# EasyEDA Pro project LEGO_HUB_v2_2026-03-08.epro

# Schematic Schematic1_1

## Sheets
1 P1: Board Name: Main_Board; Create Date: 2026-01-28; Page Name: P1; Project Name: LEGO_HUB_v2; Schematic Name: Schematic1_1; Update Date: 2026-02-18; Company: EasyEDA.com; Page Size: A4; Version: V2.0
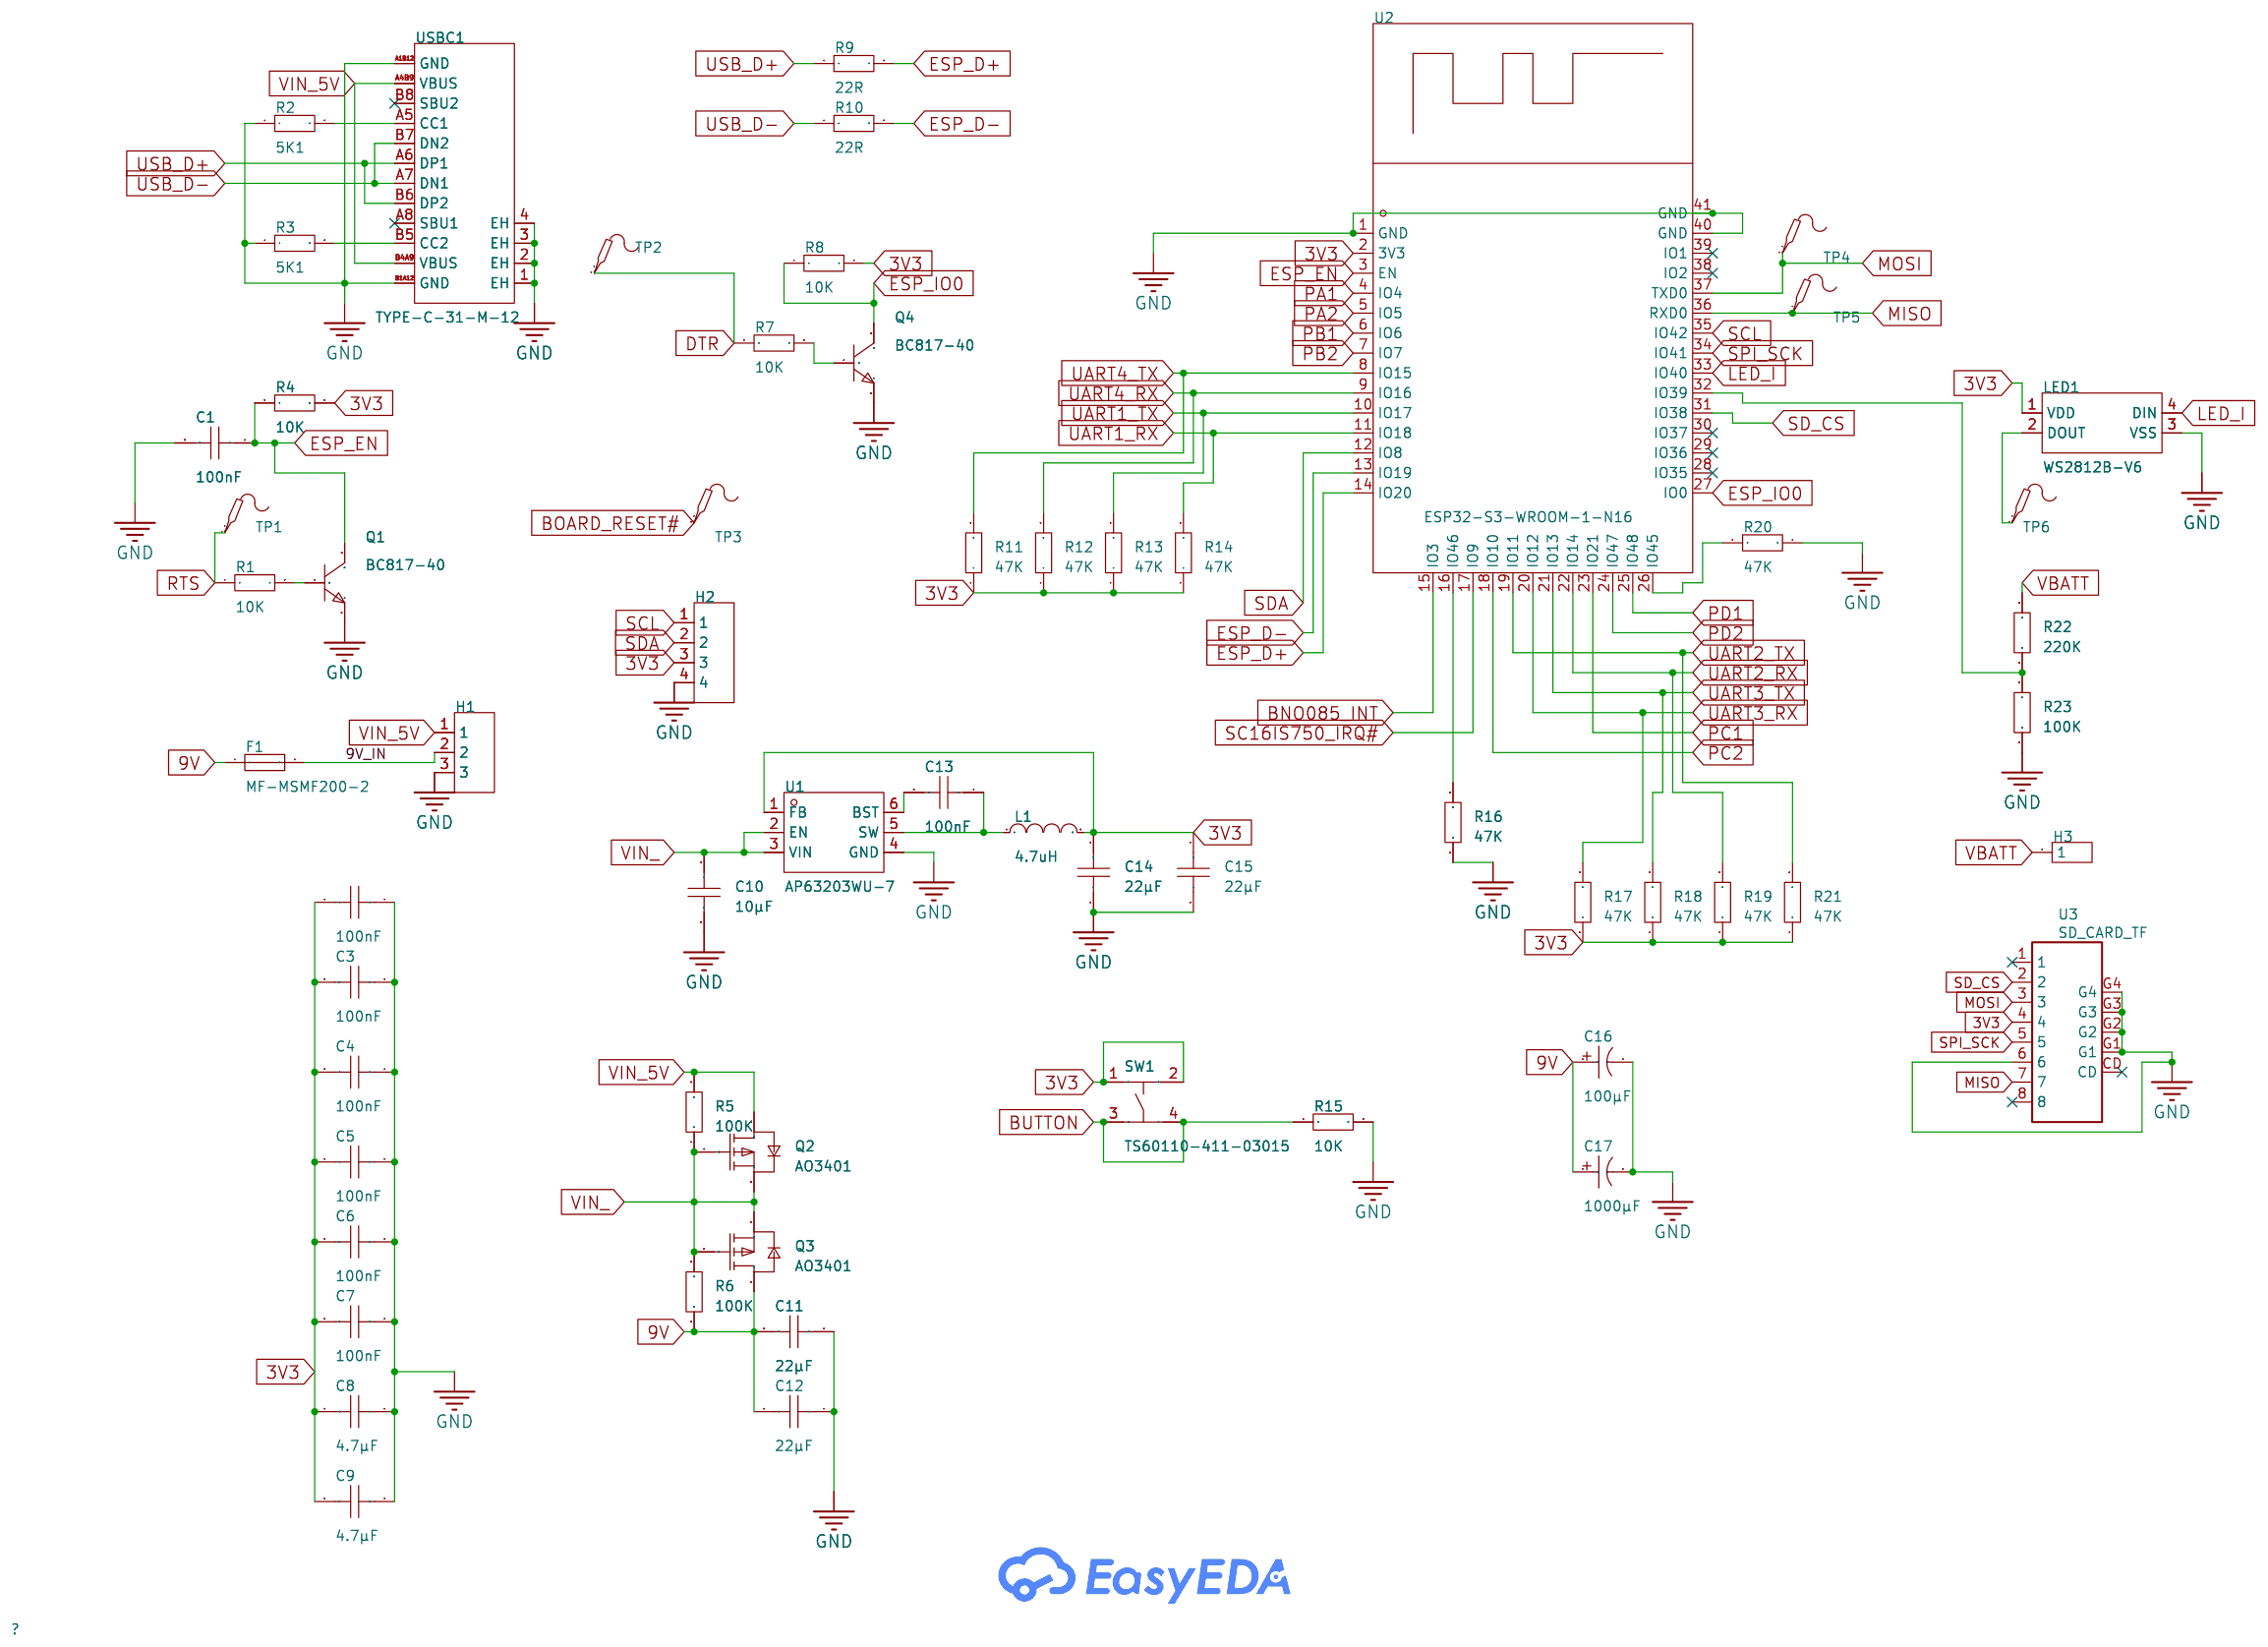
[diagram p0: P1]
2 P2: Page Name: P2; Update Date: 2026-01-28
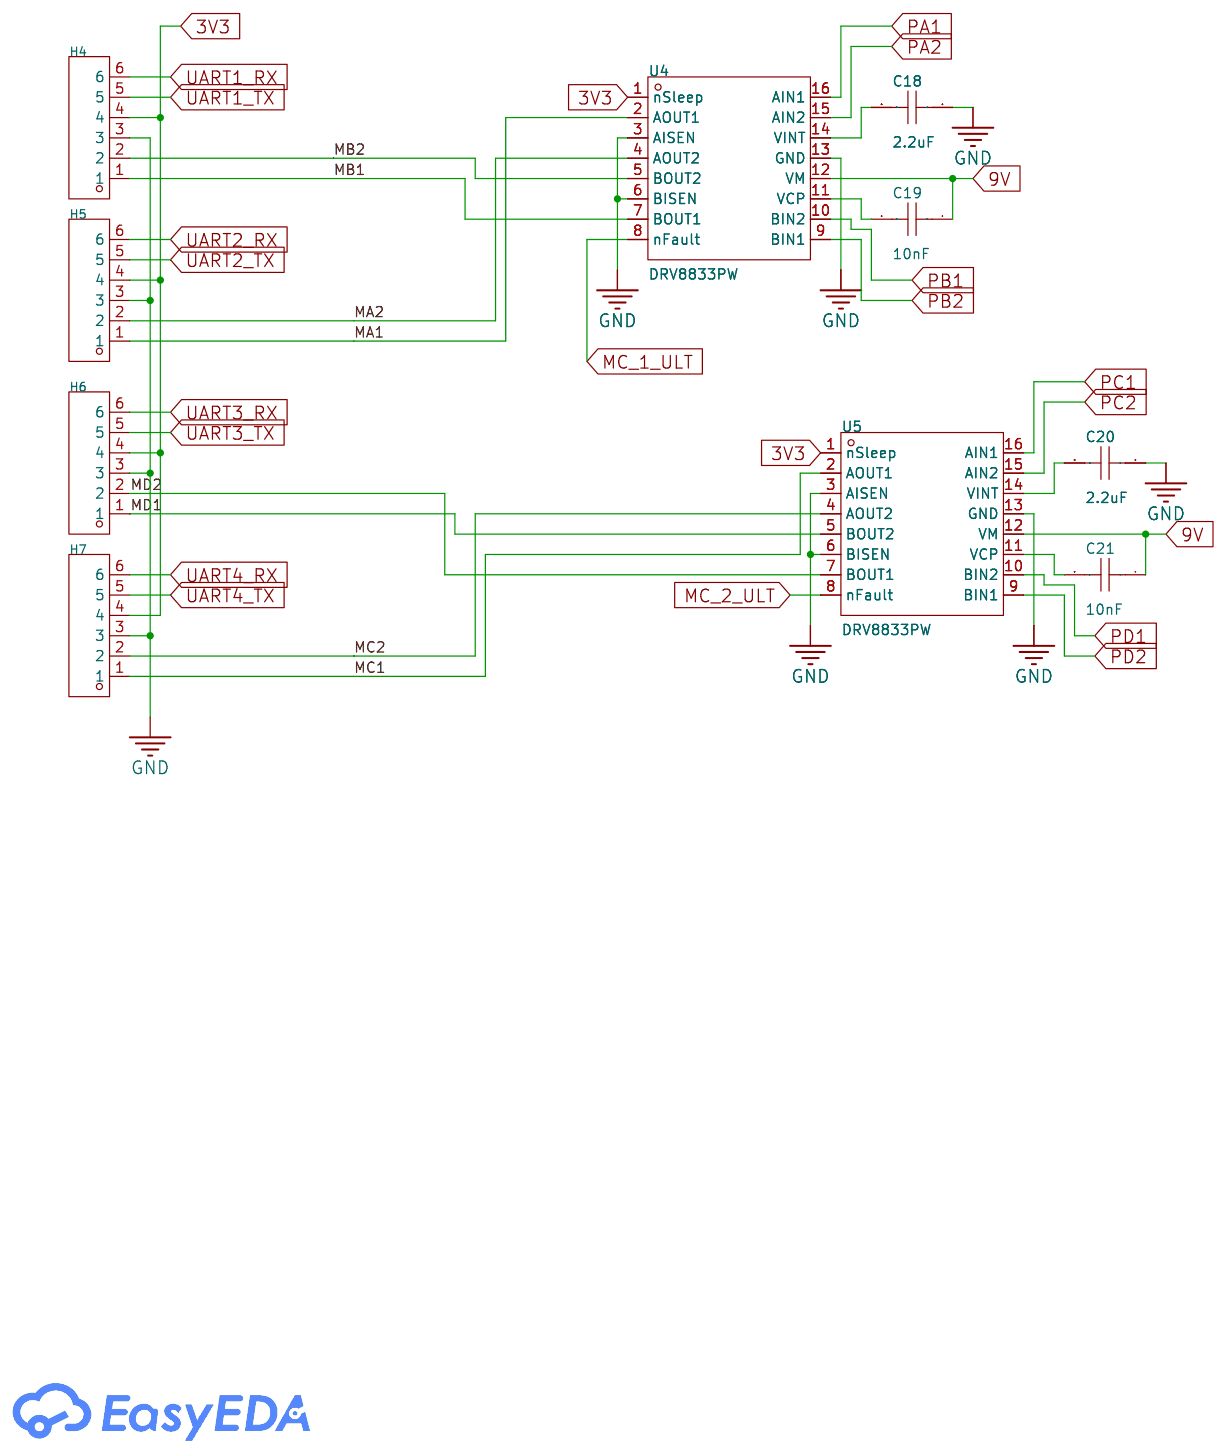
[diagram p1: P2]
3 P3: Page Name: P3; Update Date: 2026-01-28
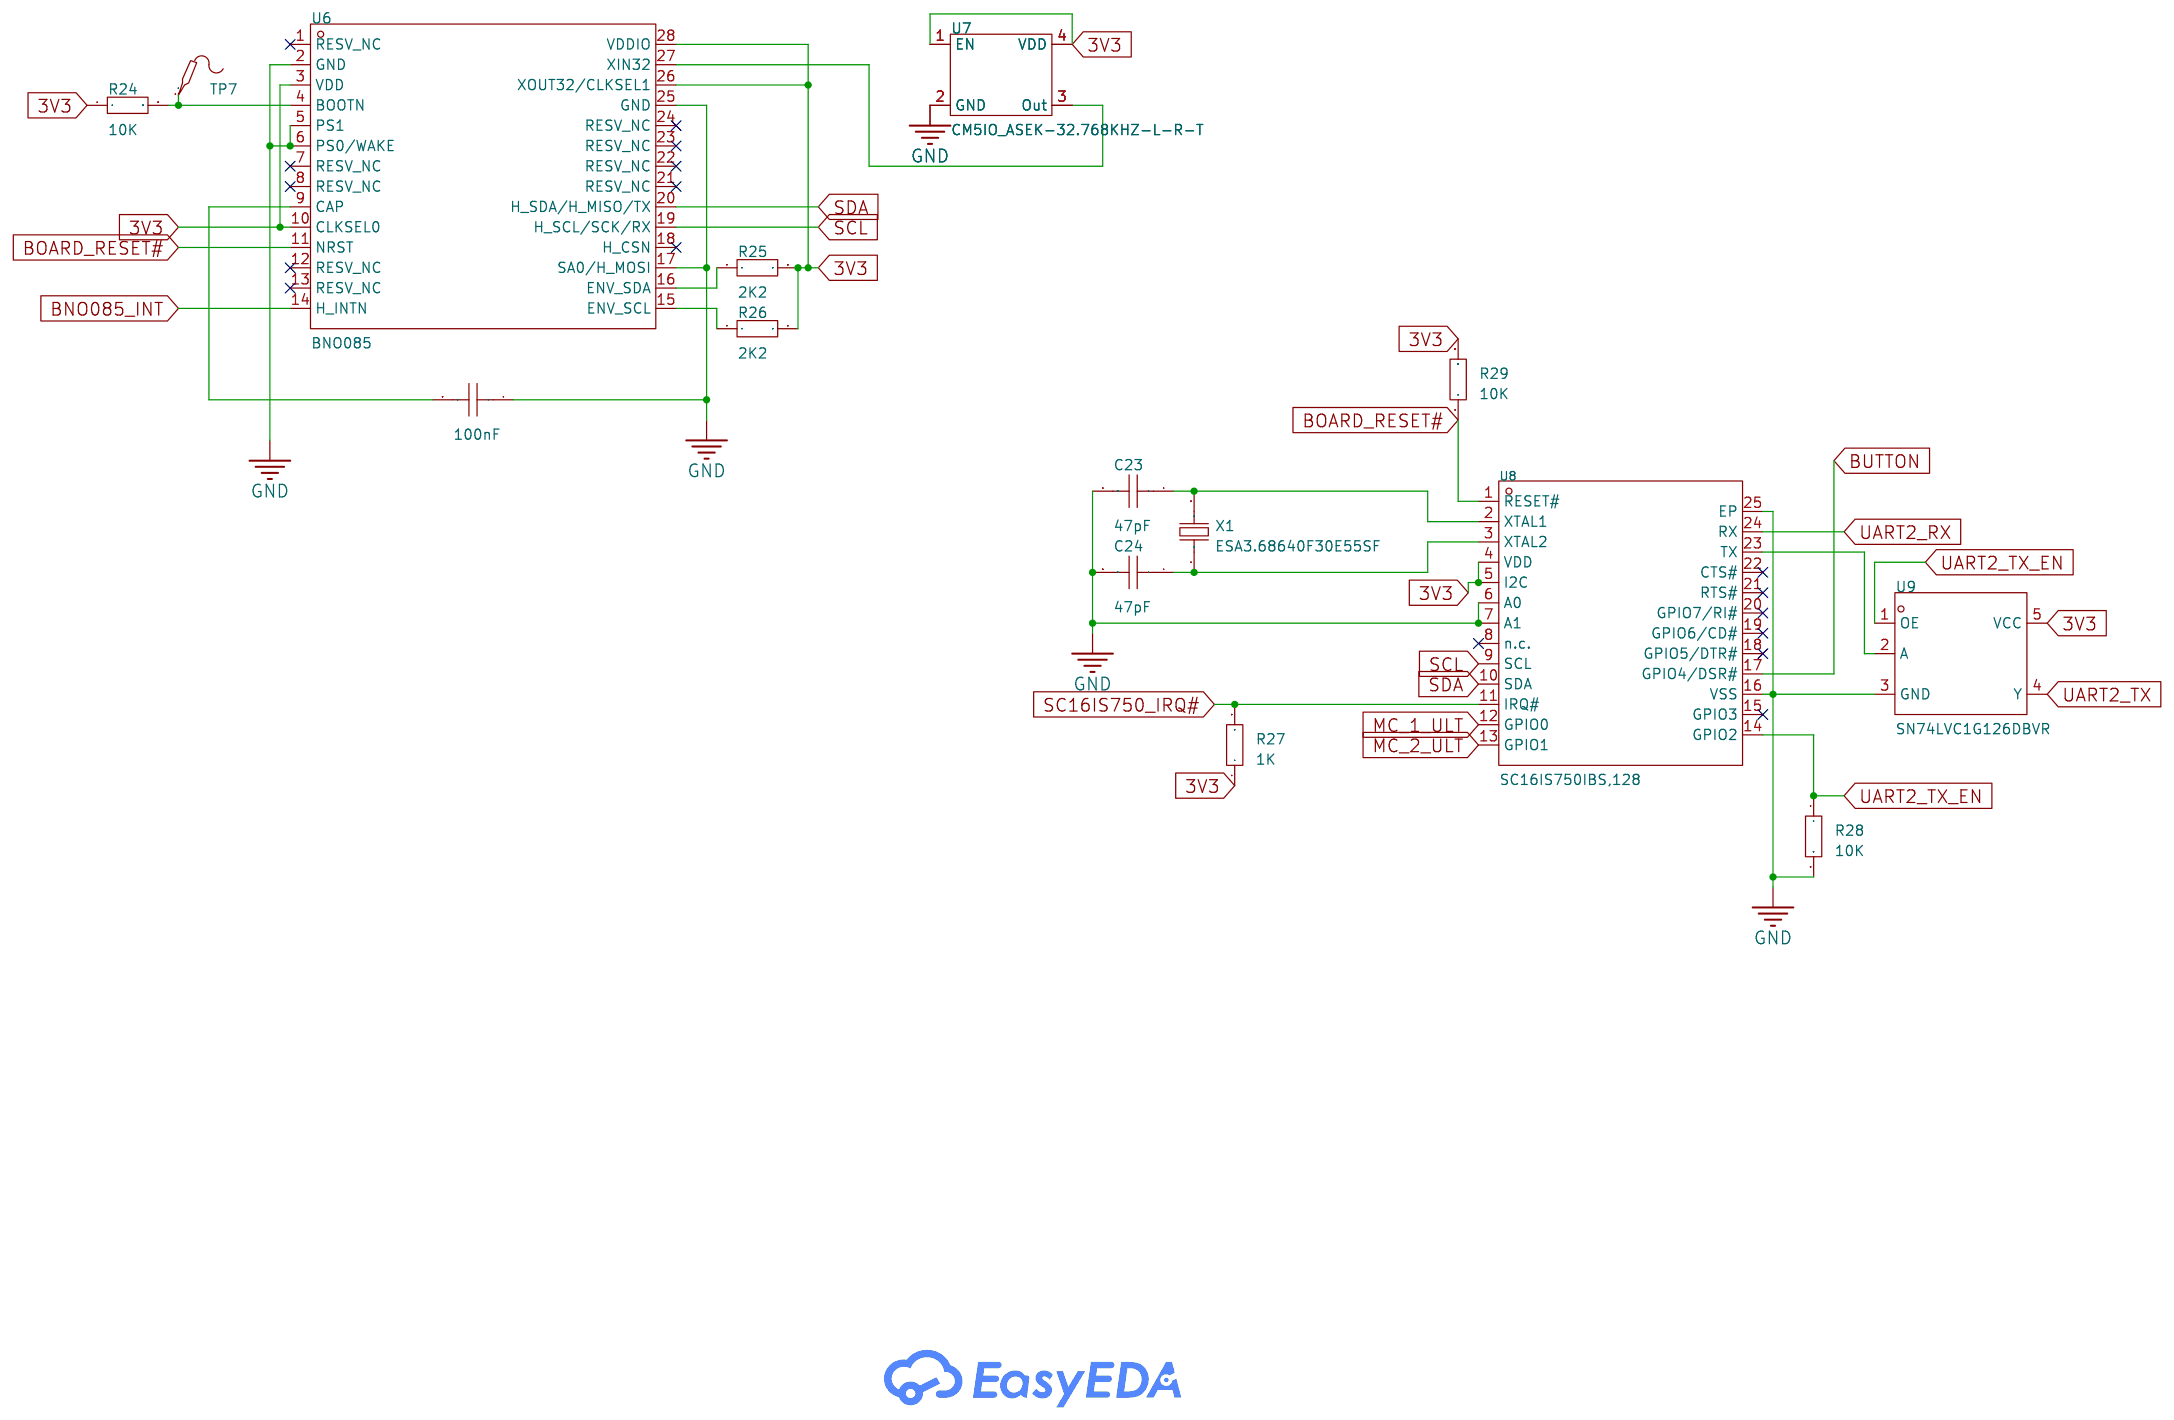
[diagram p2: P3]

## Parts
sheet P1
C1  100nF  [C0603]
C2  100nF  [C0603]
C3  100nF  [C0603]
C4  100nF  [C0603]
C5  100nF  [C0603]
C6  100nF  [C0603]
C7  100nF  [C0603]
C8  4.7μF  [C0805]
C9  4.7μF  [C0805]
C10  10μF  [C0603]
C11  22μF  [C0805]
C12  22μF  [C0805]
C13  100nF  [C0603]
C14  22μF  [C0603]
C15  22μF  [C0603]
C16  100μF  [CAP-TH_BD6.3-P2.50-D1.0-FD]
C17  1000μF  [CAP-TH_BD10.0-P5.00-D1.0-FD]
F1  MF-MSMF200-2  [F1812]
H1  -  [HDR-TH_3P-P2.54-V-F]
H2  -  [HDR-TH_4P-P2.54-V-M]
H3  -  [HDR-TH_1P-V-M_XKB_X4611WV-01I-C28D40]
L1  4.7uH  [IND-SMD_L5.8-W5.2]
LED1  WS2812B-V6  [LED-SMD_4P-L5.0-W5.0-TL-A]
Q1  BC817-40  [SOT-23-3_L2.9-W1.3-P1.90-LS2.4-BR]
Q2  AO3401  [SOT-23-3_L2.9-W1.3-P1.90-LS2.4-BR]
Q3  AO3401  [SOT-23-3_L2.9-W1.3-P1.90-LS2.4-BR]
Q4  BC817-40  [SOT-23-3_L2.9-W1.3-P1.90-LS2.4-BR]
R1  10K  [R0603]
R2  5K1  [R0603]
R3  5K1  [R0603]
R4  10K  [R0603]
R5  100K  [R0603]
R6  100K  [R0603]
R7  10K  [R0603]
R8  10K  [R0603]
R9  22R  [R0603]
R10  22R  [R0603]
R11  47K  [R0603]
R12  47K  [R0603]
R13  47K  [R0603]
R14  47K  [R0603]
R15  10K  [R0603]
R16  47K  [R0603]
R17  47K  [R0603]
R18  47K  [R0603]
R19  47K  [R0603]
R20  47K  [R0603]
R21  47K  [R0603]
R22  220K  [R0603]
R23  100K  [R0603]
SW1  TS60110-411-03015  [SW-SMD_4P-L5.2-W5.2-P3.70-LS6.4-BL]
TP1  -  [Test-Point-0.5mm]
TP2  -  [Test-Point-0.5mm]
TP3  -  [Test-Point-0.5mm]
TP4  -  [Test-Point-0.5mm]
TP5  -  [Test-Point-0.5mm]
TP6  -  [Test-Point-0.5mm]
U1  AP63203WU-7  [TSOT-26_L2.9-W1.6-P0.95-LS2.8-BL]
U2  ESP32-S3-WROOM-1-N16  [WIRELM-SMD_ESP32-S3-WROOM-1]
U3  SD_CARD_TF  [MICRO-USB-SMD_MICRO-SD]
USBC1  TYPE-C-31-M-12  [USB-C_SMD-TYPE-C-31-M-12_1]
sheet P2
C18  2.2uF  [C0603]
C19  10nF  [C0603]
C20  2.2uF  [C0603]
C21  10nF  [C0603]
H4  -  [WEDO_2.0_M]
H5  -  [WEDO_2.0_M]
H6  -  [WEDO_2.0_M]
H7  -  [WEDO_2.0_M]
U4  DRV8833PW  [TSSOP-16_L5.0-W4.4-P0.65-LS6.4-BL]
U5  DRV8833PW  [TSSOP-16_L5.0-W4.4-P0.65-LS6.4-BL]
sheet P3
C22  100nF  [C0603]
C23  47pF  [C0603]
C24  47pF  [C0603]
R24  10K  [R0603]
R25  2K2  [R0603]
R26  2K2  [R0603]
R27  1K  [R0603]
R28  10K  [R0603]
R29  10K  [R0603]
TP7  -  [Test-Point-0.5mm]
U6  BNO085  [LGA-28_L5.2-W3.8-P0.50-BL]
U7  ASEK-32.768KHZ-L-R-T  [Crystal:Crystal_SMD_3225-4Pin_3.2x2.5mm]
U8  SC16IS750IBS,128  [HVQFN-24_L4.0-W4.0-P0.50-BL-EP2.6]
U9  SN74LVC1G126DBVR  [SOT-23-5_L3.0-W1.7-P0.95-LS2.8-BR]
X1  ESA3.68640F30E55SF  [CRYSTAL-SMD_L11.4-W4.7-LS12.7]

## Library data of the parts
C1-C10 C13-C15 C18-C24 = CAP_0603: Supplier Footprint: 0603
C11 C12 = CAP_0805: Supplier Footprint: 0805
C16 = ERS1HM470E110T: Capacitance:47uF Tolerance:±20% Tolerance:±20% Voltage Rating:50V Pin Spacing:2.5mm Diameter:6.3mm Height - Seated (Max):11mm Lifetime:5000hrs@105℃; LCSC Part Name: 47uF ±20% 50V; Supplier Part: C106665; Manufacturer: AISHI(艾华集团); Supplier Footprint: 插件,D6.3xL11mm; JLCPCB Part Class: Extended Part; Datasheet: https://item.szlcsc.com/datasheet/ERS1HM470E110T/107881.html; Supplier: LCSC; Tolerance: ±20%; Voltage Rating: 50V; Pin Spacing: 2.5mm; Diameter: 6.3mm; Height - Seated (Max): 11mm; Lifetime: 5000hrs@105℃
C17 = EGD2WM100G16OT: Capacitance:10uF Tolerance:±20% Tolerance:±20% Voltage Rating:450V Ripple Current:218mA@100kHz Equivalent Series Resistance(ESR):- Pin Spacing:5mm Diameter:10mm Height - Seated (Max):16mm Lifetime:6000hrs@105℃; LCSC Part Name: 10uF ±20% 450V; Supplier Part: C106328; Manufacturer: AISHI(艾华集团); Supplier Footprint: 插件,D10xL16mm; JLCPCB Part Class: Extended Part; Datasheet: https://item.szlcsc.com/datasheet/EGD2WM100G16OT/107544.html; Supplier: LCSC; Tolerance: ±20%; Voltage Rating: 450V; Ripple Current: 218mA@100kHz; Pin Spacing: 5mm; Diameter: 10mm; Height - Seated (Max): 16mm; Lifetime: 6000hrs@105℃
F1 = MF-MSMF200-2: Voltage - Max:8V Current - Max:- Hold Current:- Trip Current:- Power Dissipation:2W Resistance - Initial (Ri) (Min):20mΩ Resistance - Post Trip (R1) (Max):80mΩ Time to Trip(Max):- Operating Temperature:-40℃~+85℃ Operating Temperature:-40℃~+85℃ Length:5.4m; LCSC Part Name: 8V 2A 1812自恢复; Supplier Part: C210837; Manufacturer: BOURNS; Supplier Footprint: 1812; JLCPCB Part Class: Extended Part; Datasheet: https://item.szlcsc.com/datasheet/MF-MSMF200-2/211715.html; Supplier: LCSC; Voltage - Max: 8V; Power Dissipation: 2W; Resistance - Initial (Ri) (Min): 20mΩ; Resistance - Post Trip (R1) (Max): 80mΩ; Operating Temperature: -40℃~+85℃; Length: 5.4mm; Width: 3.2mm
H1 = HDR-F_2.54_1x3P: Supplier Footprint: Through
H2 = HDR-M_2.54_1x4P: Supplier Footprint: Through
H3 = HDR-M_2.54_1x1P: Supplier Footprint: Through
L1 = PCD0504MT4R7: Inductance: Tolerance:±20% Tolerance:±20% Rated Current: DC Resistance (DCR):; LCSC Part Name: 4.7uH ±20%; Supplier Part: C324323; Manufacturer: Viking(光颉); Supplier Footprint: 2220; JLCPCB Part Class: Extended Part; Datasheet: https://atta.szlcsc.com/upload/public/pdf/source/20190222/C324465_D652D0977146414A08B59C9C08C2344A.pdf; Supplier: LCSC; Tolerance: ±20%
LED1 = WS2812B-V6: Supplier Part: C52917433; Manufacturer: worldsemi; Supplier Footprint: SMD5050-4P; JLCPCB Part Class: Extended Part; Datasheet: https://item.szlcsc.com/datasheet/WS2812B-V6/55827424.html; Supplier: LCSC
Q1 Q4 = BC817-40_C5249694: type:NPN Current - Collector(Ic):500mA Collector - Emitter Voltage VCEO:45V Pd - Power Dissipation:300mW DC Current Gain:100 DC Current Gain:100 Transition frequency(fT):100MHz Current - Collector Cutoff:100nA Vce Saturation(VCE(sat)):700mV Operating Temp; LCSC Part Name: NPN 电流:500mA 电压:45V; Supplier Part: C5249694; Manufacturer: ElecSuper(静芯); Supplier Footprint: SOT-23; JLCPCB Part Class: Extended Part; Datasheet: https://item.szlcsc.com/datasheet/BC817-40/5963240.html; Supplier: LCSC; type: NPN; Current - Collector(Ic): 500mA; Collector - Emitter Voltage VCEO: 45V; Pd - Power Dissipation: 300mW; DC Current Gain: 100; Transition frequency(fT): 100MHz; Current - Collector Cutoff: 100nA; Vce Saturation(VCE(sat)): 700mV; Emitter-Base Voltage(Vebo): 5V
Q2 Q3 = AO3401_C6575062: Number:1 P-Channel Drain to Source Voltage:30V Current - Continuous Drain(Id):4.1A RDS(on):65mΩ@4.5V,4A Pd - Power Dissipation:1.25W Gate Threshold Voltage (Vgs(th)):1.3V Input Capacitance(Ciss):870pF@0V Reverse Transfer Capacitance (Crss@Vds):10pF Operat; LCSC Part Name: 1个P沟道 耐压:30V 电流:4.1A; Supplier Part: C6575062; Manufacturer: YONGYUTAI(永裕泰); Supplier Footprint: SOT-23; JLCPCB Part Class: Extended Part; Datasheet: https://item.szlcsc.com/datasheet/AO3401/7529492.html; Supplier: LCSC; Number: 1 P-Channel; Drain to Source Voltage: 30V; Current - Continuous Drain(Id): 4.1A; RDS(on): 65mΩ@4.5V,4A; Pd - Power Dissipation: 1.25W; Gate Threshold Voltage (Vgs(th)): 1.3V; Input Capacitance(Ciss): 870pF@0V; Reverse Transfer Capacitance (Crss@Vds): 10pF; Operating Temperature: -55℃~+150℃; Output Capacitance(Coss): 74pF
R1-R29 = Res_0603: Supplier Footprint: 0603
SW1 = TS60110-411-03015: LCSC Part Name: 4*4*3.0 立贴   铜头轻触开关; Supplier Part: C42400889; Manufacturer: HMTCONN(华明通); Supplier Footprint: SMD-4P,5.2x5.2mm; JLCPCB Part Class: Extended Part; Datasheet: https://item.szlcsc.com/datasheet/TS60110-411-03015/44355813.html; Supplier: LCSC
TP1-TP7 = Test-Point: Test Point 测试点
U1 = AP63203WU-7: Function:Buck Voltage - Supply:3.8V~32V Voltage - Supply:3.8V~32V Output Voltage:3.3V Output Voltage:3.3V Output Current:2A Frequency - Switching:1.1MHz Frequency - Switching:1.1MHz Operating Temperature:-40℃~+85℃@(TA) Operating Temperature:-40℃~+85℃@(TA); LCSC Part Name: 3.8V至32V输入、2A低静态电流同步降压转换器，增强EMI抑制; Supplier Part: C780769; Manufacturer: DIODES(美台); Supplier Footprint: TSOT-23-6; JLCPCB Part Class: Extended Part; Datasheet: https://item.szlcsc.com/datasheet/AP63203WU-7/832852.html; Supplier: LCSC; Function: Buck; Voltage - Supply: 3.8V~32V; Output Voltage: 3.3V; Output Current: 2A; Frequency - Switching: 1.1MHz; Operating Temperature: -40℃~+85℃@(TA); Synchronous Rectifier: Yes; Number of Outputs: 1; Topology: Buck; Quiescent Current: 22uA; Switch tube (built-in/external): Built-In; Output Type: Fixed
U2 = ESP32-S3-WROOM-1-N16: LCSC Part Name: 通用型Wi-Fi+低功耗蓝牙MCU模组; Supplier Part: C2913199; Manufacturer: ESPRESSIF(乐鑫); Supplier Footprint: SMD,25.5x18mm; JLCPCB Part Class: Extended Part; Datasheet: https://item.szlcsc.com/datasheet/ESP32-S3-WROOM-1-N16/3198297.html; Supplier: LCSC
U3 = SD_CARD_TF: Supplier: LCSC; Supplier Part: C9900016722; Manufacturer: null; Manufacturer Part: SD_Card_TF; JLCPCB Part Class: Extended Part; Contributor: lcsc; spicePre: U
USBC1 = TYPE-C-31-M-12: Connector Type:Type-C Protocol Standard:- Gender:Female Mounting Type:- Number of Contacts:16P Number of Ports:1 Current Rating-Power:5A Operating Temperature:- Operating Temperature:-; LCSC Part Name: Type-C 母; Supplier Part: C165948; Manufacturer: 韩国韩荣; Supplier Footprint: SMD; JLCPCB Part Class: Extended Part; Datasheet: https://item.szlcsc.com/datasheet/TYPE-C-31-M-12/177331.html; Supplier: LCSC; Connector Type: Type-C; Gender: Female; Number of Contacts: 16P; Number of Ports: 1; Current Rating-Power: 5A
H4-H7 = HDR-F_2.54_1x6P: Supplier Footprint: Through
U4 U5 = DRV8833PW_C3681295: Supplier Part: C3681295; Manufacturer: TI(德州仪器); Supplier Footprint: TSSOP-16; JLCPCB Part Class: Extended Part; Datasheet: https://www.ti.com/cn/lit/gpn/drv8833; Supplier: LCSC
U6 = BNO085_C5189642: Accelerometer Sensing Axis:X,Y,Z Acceleration Measurement Range (MAX):±8g Acceleration Measurement Range (MAX):±8g Gyroscope Sensing Axis:X,Y,Z Gyroscope Measurement Range (MAX):±2000dps Gyroscope Measurement Range (MAX):±2000dps Sensor Type:IMU Output Bi; LCSC Part Name: 交钥匙传感器集线器解决方案; Supplier Part: C5189642; Manufacturer: CEVA; Supplier Footprint: LGA-28(3.8x5.2); JLCPCB Part Class: Extended Part; Datasheet: https://item.szlcsc.com/datasheet/BNO085/5869007.html; Supplier: LCSC; Accelerometer Sensing Axis: X,Y,Z; Acceleration Measurement Range (MAX): ±8g; Gyroscope Sensing Axis: X,Y,Z; Gyroscope Measurement Range (MAX): ±2000dps; Sensor Type: IMU; Output Bits: 16bit；12bit; Interface: UART；I2C；SPI; Voltage - Supply: 1.65V~3.6V
U7 = CM5IO_ASEK-32.768KHZ-L-R-T: Users: REF**; datasheet: https://abracon.com/Oscillators/ASEK.pdf; field7: abracon; part description: 32KHz Xtal oscilator; User doc link: https://abracon.com/Oscillators/ASEK.pdf
U8 = SC16IS750IBS,128: Number of Channels:1 Memory Size:64Byte Interface:SPI；I2C Data Rate(Max):5Mbps Voltage - Supply:3.3V；2.5V Voltage - Supply:3.3V；2.5V Features:Configurable GPIO；With automatic flow control；With IrDA Encoder/Decoder Operating Temperature:-40℃~+95℃ Operating; LCSC Part Name: 单路通用异步收发传输器（UART），具备I2C总线/SPI接口，64字节收发FIFO，内置IrDA SIR支持; Supplier Part: C2651891; Manufacturer: NXP(恩智浦); Supplier Footprint: HVQFN-24-EP(4x4); JLCPCB Part Class: Extended Part; Datasheet: https://www.nxp.com.cn/docs/en/data-sheet/SC16IS740_750_760.pdf; Supplier: LCSC; Number of Channels: 1; Memory Size: 64Byte; Interface: SPI；I2C; Data Rate(Max): 5Mbps; Voltage - Supply: 3.3V；2.5V; Features: Configurable GPIO；With automatic flow control；With IrDA Encoder/Decoder; Operating Temperature: -40℃~+95℃
U9 = SN74LVC1G126DBVR: link: https://item.szlcsc.com/236104.html; 3DModel: SOT-23-5_L2.9-W1.6-H1.1-LS2.8-P0.95; Supplier: LCSC; Manufacturer: TI; image: //image.lceda.cn/szlcsc/C23654.jpg; Supplier Part: C7834; JLCPCB Part Class: Extend
X1 = ESA3.68640F30E55SF: Supplier Part: C9900023091; Supplier Footprint: HC-49SM; JLCPCB Part Class: Extended Part; Supplier: LCSC

## Nets
3V3: C2.2 C3.2 C4.2 C5.2 C6.2 C7.2 C8.2 C9.2 C14.1 C15.1 H2.3 H4.4 H5.4 H6.4 H7.4 L1.2 LED1.1(VDD) R4.2 R8.2 R11.1 R12.1 R13.1 R14.1 R17.1 R18.1 R19.1 R21.1 R24.1 R25.2 R26.2 R27.1 R29.2 SW1.1 SW1.2 U1.1(FB) U2.2(3V3) U3.4 U4.1(nSleep) U5.1(nSleep) U6.3(VDD) U6.10(CLKSEL0) U6.26(XOUT32/CLKSEL1) U6.28(VDDIO) U7.1(EN) U7.4(VDD) U8.4(VDD) U8.5(I2C) U9.5(VCC)
9V: C11.2 C12.2 C16.1 C17.1 C19.1 C21.1 F1.1 Q3.3(D) R6.1 U4.12(VM) U5.12(VM)
9V_IN: F1.2 H1.2
GND: C1.2 C2.1 C3.1 C4.1 C5.1 C6.1 C7.1 C8.1 C9.1 C10.2 C11.1 C12.1 C14.2 C15.2 C16.2 C17.2 C18.1 C20.1 C22.1 C23.2 C24.2 H1.3 H2.4 H4.3 H5.3 H6.3 H7.3 LED1.3(VSS) Q1.2(E) Q4.2(E) R2.1 R3.1 R15.2 R16.1 R20.1 R23.1 R28.2 U1.4(GND) U2.1(GND) U2.40(GND) U2.41(GND) U3.6 U3.G1 U3.G2 U3.G3 U3.G4 U4.3(AISEN) U4.6(BISEN) U4.13(GND) U5.3(AISEN) U5.6(BISEN) U5.13(GND) U6.2(GND) U6.5(PS1) U6.6(PS0/WAKE) U6.17(SA0/H_MOSI) U6.25(GND) U7.2(GND) U8.6(A0) U8.7(A1) U8.16(VSS) U8.25(EP) U9.3(GND) USBC1.1(EH) USBC1.2(EH) USBC1.3(EH) USBC1.4(EH) USBC1.A1B12(GND) USBC1.B1A12(GND)
VBATT: H3.1 R22.2
VIN_: C10.1 Q2.1(G) Q2.2(S) Q3.1(G) Q3.2(S) R5.1 R6.2 U1.2(EN) U1.3(VIN)
VIN_5V: H1.1 Q2.3(D) R5.2 USBC1.A4B9(VBUS) USBC1.B4A9(VBUS)
BNO085_INT: U2.15(IO3) U6.14(H_INTN)
BOARD_RESET#: R29.1 TP3.1 U6.11(NRST) U8.1(RESET#)
BUTTON: R15.1 SW1.3 SW1.4 U8.17(GPIO4/DSR#)
DTR: R7.1 TP2.1
ESP_D+: R9.2 U2.14(IO20)
ESP_D-: R10.2 U2.13(IO19)
ESP_EN: C1.1 Q1.3(C) R4.1 U2.3(EN)
ESP_IO0: Q4.3(C) R8.1 U2.27(IO0)
LED_I: LED1.4(DIN) U2.33(IO40)
MA1: H5.1 U4.2(AOUT1)
MA2: H5.2 U4.4(AOUT2)
MB1: H4.1 U4.7(BOUT1)
MB2: H4.2 U4.5(BOUT2)
MC1: H7.1 U5.2(AOUT1)
MC2: H7.2 U5.4(AOUT2)
MC_1_ULT: U4.8(nFault) U8.12(GPIO0)
MC_2_ULT: U5.8(nFault) U8.13(GPIO1)
MD1: H6.1 U5.5(BOUT2)
MD2: H6.2 U5.7(BOUT1)
MISO: TP5.1 U2.36(RXD0) U3.7
MOSI: TP4.1 U2.37(TXD0) U3.3
PA1: U2.4(IO4) U4.16(AIN1)
PA2: U2.5(IO5) U4.15(AIN2)
PB1: U2.6(IO6) U4.10(BIN2)
PB2: U2.7(IO7) U4.9(BIN1)
PC1: U2.23(IO21) U5.16(AIN1)
PC2: U2.18(IO10) U5.15(AIN2)
PD1: U2.25(IO48) U5.10(BIN2)
PD2: U2.24(IO47) U5.9(BIN1)
RTS: R1.1 TP1.1
SC16IS750_IRQ#: R27.2 U2.17(IO9) U8.11(IRQ#)
SCL: H2.1 U2.35(IO42) U6.19(H_SCL/SCK/RX) U8.9(SCL)
SD_CS: U2.31(IO38) U3.2
SDA: H2.2 U2.12(IO8) U6.20(H_SDA/H_MISO/TX) U8.10(SDA)
SPI_SCK: U2.34(IO41) U3.5
UART1_RX: H4.6 R14.2 U2.11(IO18)
UART1_TX: H4.5 R13.2 U2.10(IO17)
UART2_RX: H5.6 R19.2 U2.22(IO14) U8.24(RX)
UART2_TX: H5.5 R21.2 U2.19(IO11) U9.4(Y)
UART2_TX_EN: R28.1 U8.14(GPIO2) U9.1(OE)
UART3_RX: H6.6 R17.2 U2.20(IO12)
UART3_TX: H6.5 R18.2 U2.21(IO13)
UART4_RX: H7.6 R12.2 U2.9(IO16)
UART4_TX: H7.5 R11.2 U2.8(IO15)
USB_D+: R9.1 USBC1.A6(DP1) USBC1.B6(DP2)
USB_D-: R10.1 USBC1.A7(DN1) USBC1.B7(DN2)
$1N832: R3.2 USBC1.B5(CC2)
$1N836: R2.2 USBC1.A5(CC1)
$1N2105: Q4.1(B) R7.2
$1N2214: Q1.1(B) R1.2
$1N18310: R22.1 R23.2 U2.32(IO39)
$1N21267: R16.2 U2.16(IO46)
$1N21376: R20.2 U2.26(IO45)
$1N26653: C13.1 L1.1 U1.5(SW)
$1N26903: C13.2 U1.6(BST)
$1N27406: LED1.2(DOUT) TP6.1
$2N2668: C18.2 U4.14(VINT)
$2N2750: C19.2 U4.11(VCP)
$2N2983: C20.2 U5.14(VINT)
$2N2989: C21.2 U5.11(VCP)
$3N396: R25.1 U6.16(ENV_SDA)
$3N399: R26.1 U6.15(ENV_SCL)
$3N402: R24.2 TP7.1 U6.4(BOOTN)
$3N405: C22.2 U6.9(CAP)
$3N910: U6.27(XIN32) U7.3(Out)
$3N976: C23.1 U8.2(XTAL1) X1.2
$3N1443: U8.23(TX) U9.2(A)
$3N1678: C24.1 U8.3(XTAL2) X1.1

Not connected (* = marked no-connect by the designer): U2 28(IO35)* 29(IO36)* 30(IO37)* 38(IO2)* 39(IO1)*; U3 1* 8* CD*; U6 1(RESV_NC)* 7(RESV_NC)* 8(RESV_NC)* 12(RESV_NC)* 13(RESV_NC)* 18(H_CSN)* 21(RESV_NC)* 22(RESV_NC)* 23(RESV_NC)* 24(RESV_NC)*; U8 8(n.c.)* 15(GPIO3)* 18(GPIO5/DTR#)* 19(GPIO6/CD#)* 20(GPIO7/RI#)* 21(RTS#)* 22(CTS#)*; USBC1 A8(SBU1)* B8(SBU2)*

# Board PCB_v2
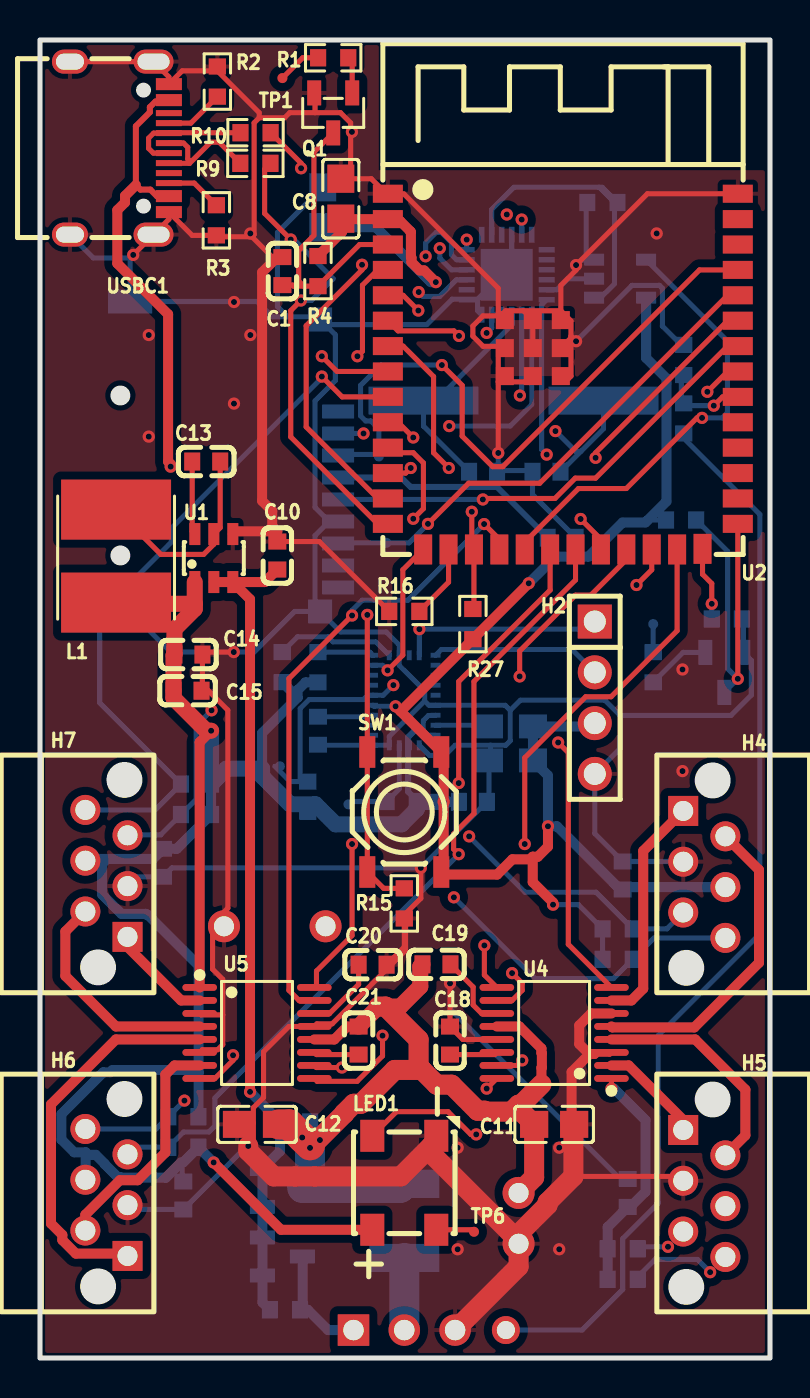
[diagram p3: board, top side]
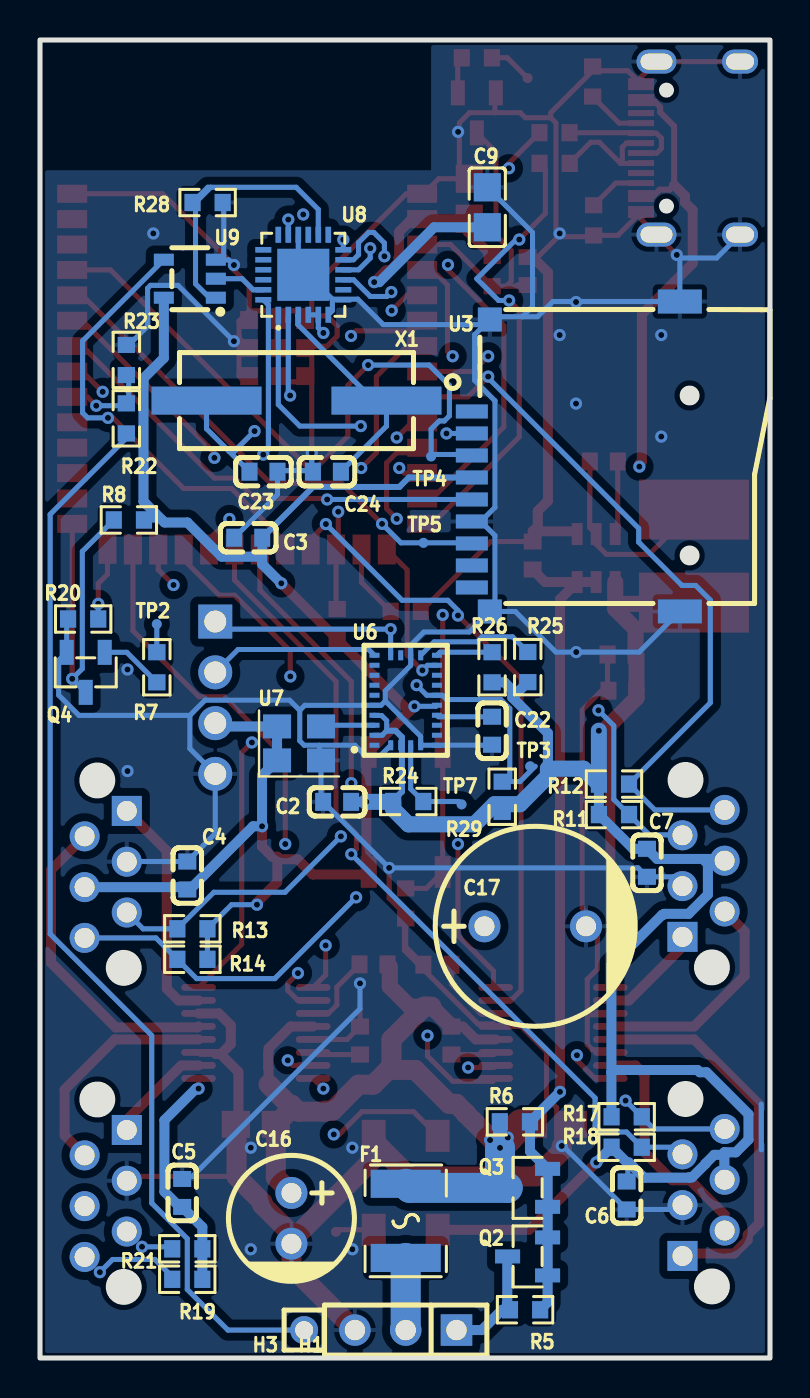
[diagram p4: board, bottom side, seen from below]

Outline 36.51 x 65.91 mm; copper layers: Top Layer, Inner1, Inner2, Bottom Layer. Coordinates in mm from the lower left corner of the outline.
Outline path: rectangle 0,65.91 36.51,0
Stack: Top Layer 0.035mm Outer layer thickness 1oz / Dielectric1 0.2104mm 7628 RC49% 8.6mil / Inner1 0.0152mm Inner layer thickness / Dielectric2 1.065mm 1.1mm H/HOZ Copper / Inner2 0.0152mm Inner layer thickness / Dielectric3 0.2104mm 7628 RC49% 8.6mil / Bottom Layer 0.035mm Outer layer thickness 1oz

## Design rules (mm)
net ESP_D+: ESP_D
net USB_D+: DP1
net ESP_D-: ESP_D
net USB_D-: DP1
template: Custom Config
spacing copperThickness1oz (default): track to track 0.102, other pairs 0.152 to 0.3
spacing copperThickness2oz: track to track 0.203, other pairs 0.152 to 0.3
spacing safeClearance1: track to track 0.3, other pairs 0.3 to 0.6
track width copperThickness1oz (default): min 0.127, default 0.254, max 3
track width copperThickness2oz: min 0.203, default 0.254, max 2.54
track width power: min 0.5, default 0.5, max 3
track width power2: min 1, default 1, max 3
differential pair differentialPair (default): width min 0.127, default 0.254, max 2.54; gap min 0.152, default 0.152
via viaSize (default): diameter min 0.5, default 0.61, max 10; hole min 0.3, default 0.305, max 6.3
net 9V uses power
net VIN_ uses power
net MA2 uses power
net MA1 uses power
net MB2 uses power
net MB1 uses power
net MC2 uses power
net MC1 uses power
net MD2 uses power
net MD1 uses power
net 9V_IN uses power2, safeClearance1

## Placement (name value [footprint] x y rotation side)
C1  100nF  [C0603]  12.12 54.36 90 top
C2  100nF  [C0603]  21.65 27.81 180 bottom
C3  100nF  [C0603]  26.09 41.02 180 bottom
C4  100nF  [C0603]  29.14 24.13 270 bottom
C5  100nF  [C0603]  29.39 8.25 270 bottom
C6  100nF  [C0603]  7.17 8.13 90 bottom
C7  100nF  [C0603]  6.15 24.77 90 bottom
C8  4.7μF  [C0805]  15.04 57.98 270 top
C9  4.7μF  [C0805]  14.14 57.55 270 bottom
C10  10μF  [C0603]  11.87 40.13 90 top
C11  22μF  [C0805]  25.71 11.68 180 top
C12  22μF  [C0805]  10.85 11.68 0 top
C13  100nF  [C0603]  8.31 44.83 180 top
C14  22μF  [C0603]  7.42 35.18 0 top
C15  22μF  [C0603]  7.38 33.37 0 top
C16  100μF  [CAP-TH_BD6.3-P2.50-D1.0-FD]  23.93 6.98 270 bottom
C17  1000μF  [CAP-TH_BD10.0-P5.00-D1.0-FD]  11.74 21.59 180 bottom
C18  2.2uF  [C0603]  20.5 15.88 270 top
C19  10nF  [C0603]  19.83 19.69 0 top
C20  2.2uF  [C0603]  16.63 19.67 180 top
C21  10nF  [C0603]  15.93 15.88 270 top
C22  100nF  [C0603]  13.9 31.37 90 bottom
C23  47pF  [C0603]  25.33 44.32 180 bottom
C24  47pF  [C0603]  22.16 44.32 0 bottom
F1  MF-MSMF200-2  [F1812]  18.22 6.86 270 bottom
H1  -  [HDR-TH_3P-P2.54-V-F]  18.22 1.4 0 bottom
H2  -  [HDR-TH_4P-P2.54-V-M]  27.74 33.02 270 top
H3  -  [HDR-TH_1P-V-M_XKB_X4611WV-01I-C28D40]  23.3 1.4 180 bottom
H4  -  [WEDO_2.0_M]  34.27 23.55 270 top
H5  -  [WEDO_2.0_M]  34.27 7.59 270 top
H6  -  [WEDO_2.0_M]  2.27 8.91 90 top
H7  -  [WEDO_2.0_M]  2.27 24.87 90 top
L1  4.7uH  [IND-SMD_L5.8-W5.2]  3.8 40.1 90 top
LED1  WS2812B-V6  [LED-SMD_4P-L5.0-W5.0-TL-A]  18.22 8.76 90 top
Q1  BC817-40  [SOT-23-3_L2.9-W1.3-P1.90-LS2.4-BR]  14.66 62.27 90 top
Q2  AO3401  [SOT-23-3_L2.9-W1.3-P1.90-LS2.4-BR]  12.12 5.08 180 bottom
Q3  AO3401  [SOT-23-3_L2.9-W1.3-P1.90-LS2.4-BR]  12.12 8.51 180 bottom
Q4  BC817-40  [SOT-23-3_L2.9-W1.3-P1.90-LS2.4-BR]  34.22 34.29 90 bottom
R1  10K  [R0603]  14.66 65.02 0 top
R2  5K1  [R0603]  8.87 63.83 270 top
R3  5K1  [R0603]  8.82 56.9 90 top
R4  10K  [R0603]  13.9 54.36 90 top
R5  100K  [R0603]  12.25 2.41 0 bottom
R6  100K  [R0603]  12.76 11.81 180 bottom
R7  10K  [R0603]  30.66 34.54 270 bottom
R8  10K  [R0603]  32.06 41.91 180 bottom
R9  22R  [R0603]  10.77 59.74 0 top
R10  22R  [R0603]  10.78 61.28 0 top
R11  47K  [R0603]  7.8 27.18 180 bottom
R12  47K  [R0603]  7.8 28.7 180 bottom
R13  47K  [R0603]  28.89 21.46 0 bottom
R14  47K  [R0603]  28.89 19.94 0 bottom
R15  10K  [R0603]  18.22 22.73 270 top
R16  47K  [R0603]  18.22 37.34 0 top
R17  47K  [R0603]  7.17 12.06 180 bottom
R18  47K  [R0603]  7.17 10.54 180 bottom
R19  47K  [R0603]  29.14 3.94 0 bottom
R20  47K  [R0603]  34.35 36.96 180 bottom
R21  47K  [R0603]  29.14 5.46 0 bottom
R22  220K  [R0603]  32.19 46.99 270 bottom
R23  100K  [R0603]  32.19 49.91 270 bottom
R24  10K  [R0603]  18.09 27.83 180 bottom
R25  2K2  [R0603]  12.11 34.55 270 bottom
R26  2K2  [R0603]  13.9 34.54 270 bottom
R27  1K  [R0603]  21.65 36.7 90 top
R28  10K  [R0603]  28.12 57.78 180 bottom
R29  10K  [R0603]  13.39 28.07 270 bottom
SW1  TS60110-411-03015  [SW-SMD_4P-L5.2-W5.2-P3.70-LS6.4-BL]  18.22 27.3 90 top
TP1  -  [Test-Point-0.5mm]  12.12 64.01 0 top
TP2  -  [Test-Point-0.5mm]  30.66 36.7 180 bottom
TP3  -  [Test-Point-0.5mm]  12 29.59 180 bottom
TP4  -  [Test-Point-0.5mm]  16.95 45.08 180 bottom
TP5  -  [Test-Point-0.5mm]  17.33 40.77 180 bottom
TP6  -  [Test-Point-0.5mm]  21.7 6.31 0 top
TP7  -  [Test-Point-0.5mm]  15.42 27.69 180 bottom
U1  AP63203WU-7  [TSOT-26_L2.9-W1.6-P0.95-LS2.8-BL]  8.69 40 0 top
U2  ESP32-S3-WROOM-1-N16  [WIRELM-SMD_ESP32-S3-WROOM-1]  26.15 49.33 0 top
U3  SD_CARD_TF  [MICRO-USB-SMD_MICRO-SD]  9.71 45.08 90 bottom
U4  DRV8833PW  [TSSOP-16_L5.0-W4.4-P0.65-LS6.4-BL]  25.71 16.26 90 top
U5  DRV8833PW  [TSSOP-16_L5.0-W4.4-P0.65-LS6.4-BL]  10.85 16.26 270 top
U6  BNO085  [LGA-28_L5.2-W3.8-P0.50-BL]  18.22 32.89 180 bottom
U7  ASEK-32.768KHZ-L-R-T  [Crystal:Crystal_SMD_3225-4Pin_3.2x2.5mm]  23.55 30.73 180 bottom
U8  SC16IS750IBS,128  [HVQFN-24_L4.0-W4.0-P0.50-BL-EP2.6]  23.34 54.17 180 bottom
U9  SN74LVC1G126DBVR  [SOT-23-5_L3.0-W1.7-P0.95-LS2.8-BR]  29.01 53.97 180 bottom
USBC1  TYPE-C-31-M-12  [USB-C_SMD-TYPE-C-31-M-12_1]  3.97 60.51 270 top
X1  ESA3.68640F30E55SF  [CRYSTAL-SMD_L11.4-W4.7-LS12.7]  23.68 47.88 0 bottom

## Footprints (pads in the part's own frame, mm; a bottom-side part is the same pattern mirrored in y, then rotated)
C0603
  rect 0.8x0.9 smd: 1(-0.7,0) 2(0.7,0)
C0805
  rect 1.41x1.35 smd: 1(-1,0) 2(1,0)
CAP-TH_BD6.3-P2.50-D1.0-FD
  round 1.6 hole 1: 1(-1.27,0) 2(1.27,0)
CAP-TH_BD10.0-P5.00-D1.0-FD
  round 1.6 hole 1: 1(-2.54,0) 2(2.54,0)
CRYSTAL-SMD_L11.4-W4.7-LS12.7
  rect 5.5x1.4 smd: 1(-4.5,0) 2(4.5,0)
Crystal:Crystal_SMD_3225-4Pin_3.2x2.5mm
  rect 1.4x1.2 smd: 1(-1.1,-0.85) 2(1.1,-0.85) 3(1.1,0.85) 4(-1.1,0.85)
F1812
  rect 1.407x3.499 smd: 1(-1.853,0) 2(1.853,0)
HDR-TH_1P-V-M_XKB_X4611WV-01I-C28D40
  round 1.4 hole 0.9: 1(0,0)
HDR-TH_3P-P2.54-V-F
  rect 1.575x1.575 hole 1.02: 1(-2.54,0)
  round 1.575 hole 1.02: 2(0,0) 3(2.54,0)
HDR-TH_4P-P2.54-V-M
  rect 1.7x1.7 hole 1.1: 1(-3.81,0)
  round 1.7 hole 1.1: 2(-1.27,0) 3(1.27,0) 4(3.81,0)
HVQFN-24_L4.0-W4.0-P0.50-BL-EP2.6
  rect 0.28x0.8 smd: 1(-1.25,-2) 2(-0.75,-2) 3(-0.25,-2) 4(0.25,-2) 5(0.75,-2) 6(1.25,-2) 13(1.25,2) 14(0.75,2) 15(0.25,2) 16(-0.25,2) 17(-0.75,2) 18(-1.25,2)
  rect 0.8x0.28 smd: 7(2,-1.25) 8(2,-0.75) 9(2,-0.25) 10(2,0.25) 11(2,0.75) 12(2,1.25) 19(-2,1.25) 20(-2,0.75) 21(-2,0.25) 22(-2,-0.25) 23(-2,-0.75) 24(-2,-1.25)
  rect 2.6x2.6 smd: 25(0,0)
IND-SMD_L5.8-W5.2
  rect 3x5.5 smd: 1(2.325,0) 2(-2.325,0)
LED-SMD_4P-L5.0-W5.0-TL-A
  rect 1.6x1.2 smd: 1(-2.35,1.6) 2(-2.35,-1.6) 3(2.35,-1.6) 4(2.35,1.6)
LGA-28_L5.2-W3.8-P0.50-BL
  rect 0.5x0.25 smd: 1(-1.563,-2.25) 6(1.563,-2.25) 7(1.563,-1.75) 8(1.563,-1.25) 9(1.563,-0.75) 10(1.563,-0.25) 11(1.563,0.25) 12(1.563,0.75) 13(1.563,1.25) 14(1.563,1.75) 15(1.563,2.25) 20(-1.563,2.25) 21(-1.563,1.75) 22(-1.563,1.25) 23(-1.563,0.75) 24(-1.563,0.25) 25(-1.563,-0.25) 26(-1.563,-0.75) 27(-1.563,-1.25) 28(-1.563,-1.75)
  rect 0.25x0.5 smd: 2(-0.75,-2.25) 3(-0.25,-2.25) 4(0.25,-2.25) 5(0.75,-2.25) 16(0.75,2.25) 17(0.25,2.25) 18(-0.25,2.25) 19(-0.75,2.25)
MICRO-USB-SMD_MICRO-SD
  rect 0.7x1.6 smd: 1(2.25,5.2) 2(1.15,5.2) 3(0.05,5.2) 4(-1.05,5.2) 5(-2.15,5.2) 6(-3.25,5.2) 7(-4.35,5.2) 8(-5.45,5.2) CD(-6.55,5.2)
  rect 1.2x1.2 smd: G1(-7.75,4.3) G4(6.85,4.3)
  rect 1.2x2.2 smd: G2(-7.75,-5.2) G3(7.75,-5.2)
R0603
  rect 0.806x0.864 smd: 1(-0.753,0) 2(0.753,0)
SOT-23-3_L2.9-W1.3-P1.90-LS2.4-BR
  rect 1.25x0.7 smd: 1(1,-0.95) 2(1,0.95) 3(-1,0)
SOT-23-5_L3.0-W1.7-P0.95-LS2.8-BR
  rect 1x0.6 smd: 1(1.3,-0.95) 2(1.3,0) 3(1.3,0.95) 4(-1.3,0.95) 5(-1.3,-0.95)
SW-SMD_4P-L5.2-W5.2-P3.70-LS6.4-BL
  rect 1.58x0.8 smd: 1(-3,-1.85) 2(3,-1.85) 3(-3,1.85) 4(3,1.85)
Test-Point-0.5mm
  round 0.5 smd: 1(0,0)
TSOT-26_L2.9-W1.6-P0.95-LS2.8-BL
  rect 0.55x1.1 smd: 1(-0.95,-1.2) 2(0,-1.2) 3(0.95,-1.2) 4(0.95,1.2) 5(0,1.2) 6(-0.95,1.2)
TSSOP-16_L5.0-W4.4-P0.65-LS6.4-BL
  oval 0.343x1.732 smd: 1(-2.275,-2.866) 2(-1.625,-2.866) 3(-0.975,-2.866) 4(-0.325,-2.866) 5(0.325,-2.866) 6(0.975,-2.866) 7(1.625,-2.866) 8(2.275,-2.866) 9(2.275,2.866) 10(1.625,2.866) 11(0.975,2.866) 12(0.325,2.866) 13(-0.325,2.866) 14(-0.975,2.866) 15(-1.625,2.866) 16(-2.275,2.866)
USB-C_SMD-TYPE-C-31-M-12_1
  oval 1.2x2 hole 0.8x1.6: 1(4.325,1.706) 4(-4.325,1.706)
  oval 1.2x1.8 hole 0.8x1.4: 2(4.325,-2.474) 3(-4.325,-2.474)
  custom 0.6x1.3 smd: A1B12(-3.2,2.474) A4B9(-2.4,2.474) B1A12(3.2,2.474) B4A9(2.401,2.474)
  rect 0.3x1.3 smd: A5(-1.25,2.474) A6(-0.25,2.474) A7(0.25,2.474) A8(1.25,2.474) B5(1.75,2.474) B6(0.75,2.474) B7(-0.75,2.474) B8(-1.75,2.474)
WEDO_2.0_M
  rect 1.5x1.5 hole 1: 1(-3.81,-2.108)
  round 1.5 hole 1: 2(-2.54,0) 3(-1.27,-2.108) 4(0,0) 5(1.27,-2.108) 6(2.54,0)
WIRELM-SMD_ESP32-S3-WROOM-1
  rect 1.5x0.9 smd: 1(-8.75,8.895) 2(-8.75,7.625) 3(-8.75,6.355) 4(-8.75,5.085) 5(-8.75,3.815) 6(-8.75,2.545) 7(-8.75,1.275) 8(-8.75,0.005) 9(-8.75,-1.265) 10(-8.75,-2.535) 11(-8.75,-3.805) 12(-8.75,-5.075) 13(-8.75,-6.345) 14(-8.75,-7.615) 27(8.75,-7.615) 28(8.75,-6.345) 29(8.75,-5.075) 30(8.75,-3.805) 31(8.75,-2.535) 32(8.75,-1.265) 33(8.75,0.005) 34(8.75,1.275) 35(8.75,2.545) 36(8.75,3.815) 37(8.75,5.085) 38(8.75,6.355) 39(8.75,7.625) 40(8.75,8.895)
  rect 0.9x1.5 smd: 15(-6.985,-8.895) 16(-5.715,-8.895) 17(-4.445,-8.895) 18(-3.175,-8.895) 19(-1.905,-8.895) 20(-0.635,-8.895) 21(0.635,-8.895) 22(1.905,-8.895) 23(3.175,-8.895) 24(4.445,-8.895) 25(5.715,-8.895) 26(6.985,-8.865)
  rect 0.9x0.9 smd: 41(-2.9,2.575) 41(-2.9,1.175) 41(-2.9,-0.225) 41(-1.5,2.575) 41(-1.5,1.175) 41(-1.5,-0.225) 41(-0.1,2.575) 41(-0.1,1.175) 41(-0.1,-0.225)

## Nets
As in the schematic.

Pads without a net: U2 28 29 30 38 39; U3 1 8 CD; U6 1 7 8 12 13 18 21 22 23 24; U8 8 15 18 19 20 21 22; USBC1 A8 B8

## Via types
v1: diameter 0.61, hole 0.305, Top Layer to Bottom Layer, 99 vias

## Routing (per net, layer and track width the routed paths; a pad name or vN(x,y) marks a point on that pad's centre or on a via; arc(x,y) is an arc through that point)
3V3: length 262.3
  Top Layer w0.254: v1(28.58,13.47) U4.1 ; 15.06,56.95 C8.2
  Top Layer w0.5: v1(17.78,32.59) SW1.2 20.19,30.19 v1(20.19,27.81) 20.19,24.42 SW1.1 20.19,24.18 22.86,24.18 23.62,24.94 24.51,24.94 24.64,25.07 ; LED1.1 12.05,6.41 v1(8.68,9.78) ; v1(25.4,26.59) 25.4,25.57 24.89,25.07 24.64,25.07 ; v1(24.44,38.74) R27.1 18.04,32.34 ; R4.2 15.11,56.32 15.11,56.95 U2.2 17.5,56.85 18.02,56.85 18.53,56.34 18.53,56.32 18.55,56.3 18.55,55.05 18.58,55.02 18.58,54.8 18.99,54.39 19.21,54.39 v1(19.79,53.8) ; 24.64,25.07 24.64,23.8 25.66,22.78 v1(25.66,22.67) ; 7.99,18.53 7.99,30.8 v1(8.56,31.37)
  Top Layer w0.8: 7.74,37.72 7.74,38.8 ; 7.74,37.72 3.86,37.72 L1.2 ; 7.74,37.72 7.74,37.46 6.72,36.45 6.72,35.18 6.68,35.13 C15.1 6.68,33 8.31,31.37 v1(8.56,31.37)
  Inner1 w1: v1(22.34,51.26) 22.66,50.94 22.66,47.89 24.31,46.24 24.31,38.87 v1(24.44,38.74) ; v1(28.58,13.47) U4.1 25.66,16.9 v1(25.66,22.67)
  Inner2 w0.5: v1(28.58,13.47) 28.58,12.88 31.43,10.03 32.52,10.03 32.54,10.02 32.64,10.02 34.16,8.49 34.16,7.7 H5.4
  Inner2 w1: v1(22.34,51.26) v1(19.79,53.8)
  Bottom Layer w0.25: U6.10 16.71,32.59 v1(17.78,32.59) ; 19.78,31.14 19.4,31.14 19.17,31.37 19.17,31.88 19.42,32.13 19.77,32.13 19.78,32.14
  Bottom Layer w0.254: 25.39,40.46 C3.2 ; U8.4 U8.5 22.59,51.52 v1(22.34,51.26) ; 18.91,27.81 R24.1 ; v1(25.66,22.67) 26.93,22.67 R13.1 R14.1 ; 30.4,41.91 R8.2 ; 7.11,9.78 7.11,8.89 C6.2
  Bottom Layer w0.3: U3.4 18.06,44.03 18.53,43.56 22.85,43.56 C3.2 ; 19.17,31.37 18.73,31.37 18.41,31.05 18.41,28.32 18.91,27.81
  Bottom Layer w0.5: H6.4 2.28,8.93 2.28,10.29 ; 3.36,24.96 3.1,24.7 3.1,23.18 4.07,22.21 5.29,22.21 5.34,22.16 5.39,22.16 7.93,19.62 7.93,14.29 ; 3.36,24.96 5.65,24.96 C7.2 6.84,25.46 R11.1 R12.1 ; 3.36,24.96 2.36,24.96 H7.4 ; 11.11,29.47 11.11,31.25 12.88,33.03 ; 25.39,40.33 25.39,40.46 ; 25.39,40.33 25.65,40.08 27.42,40.08 29.13,41.78 30.27,41.78 31.33,42.84 31.33,48.75 ; 25.39,40.33 25.39,39.69 v1(24.44,38.74) ; H2.3 27.58,31.58 U7.4 U7.1 25.4,29.13 v1(25.4,26.59) 25.85,26.59 29.01,23.43 C4.2 29.26,23.55 H4.4 ; 31.33,48.75 31.33,48.99 30.31,50.01 U9.5 ; 7.11,9.78 7.06,9.78 6.3,9.02 4.06,9.02 4.04,9.03 3.9,9.03 3.23,9.71 3.23,9.72 2.79,10.16 2.41,10.16 2.28,10.29 ; C9.2 16.8,56.55 19.54,53.8 v1(19.79,53.8) ; v1(28.58,13.47) 28.7,13.47 30.28,11.89 30.28,8.32 29.52,7.56 C5.2 28.39,6.55 R21.1 R19.1 ; 2.28,10.29 1.71,10.29 1.07,10.92 1.07,12.19 3.17,14.29 3.51,14.29 3.62,14.4 7.82,14.4 7.93,14.29 ; 7.93,14.29 7.93,12.07 R17.1 ; 12.88,33.03 12.88,33.4 13.27,33.79 R26.2 ; 12.88,33.03 12.11,33.8 ; C2.2 v1(20.19,27.81) ; v1(8.68,9.78) R18.1 7.16,9.78
  Bottom Layer w0.8: v1(20.19,27.81) 18.91,27.81 ; v1(8.56,31.37) R12.1 9.33,29.47 11.11,29.47 11.11,29.09 12.5,27.69 13.77,27.69 14.78,26.69 18.08,26.69 18.84,27.45 R24.1
9V: length 58.3
  Top Layer w0.5: 23.93,12.67 24.06,12.67 ; 25.08,13.68 25.08,14.51 25.1,14.53 25.1,15.24 25.08,15.26 25.08,15.48 23.97,16.58 22.84,16.58 ; U5.12 14.72,15.93 15.36,16.57 15.93,16.57
  Top Layer w0.8: 17.28,17.57 18.02,17.57 19.02,18.57 19.02,19.57 C19.1 ; 15.93,16.57 16.93,17.57
  Top Layer w1: 19.1,14.41 19.84,13.67 20.58,13.67 21.88,12.37 22.23,12.37 22.28,12.32 23.58,12.32 23.93,12.67 23.93,12.46 C11.2 24.71,9.03 C16.1 ; 19.1,14.41 18.93,14.57 18.93,15.92 17.28,17.57 16.93,17.57 ; 19.1,14.41 17.74,14.41 16.05,12.71 15.69,12.71 15.22,12.24 15.22,12.22 v1(13.5,10.51) ; 24.06,12.67 25.08,13.68
  Top Layer w1.5: 13.5,10.64 v1(13.11,11.03) 12.46,11.68 11.95,11.68
  Inner2 w3: v1(13.5,10.51) 12.76,11.25 12.76,20.07 14.28,21.59
  Bottom Layer w0.7: R6.1 13.5,11.8 v1(13.5,10.51)
  Bottom Layer w1.5: F1.1 18.02,8.51 Q3.3 13.5,8.89 v1(13.5,10.51)
  vias: v1(14,10.9)
9V_IN: length 3.6
  Bottom Layer w1.5: H1.2 F1.2
GND: length 392.3
  Top Layer w0.254: 27.72,15.2 27.73,15.19 28.49,15.19 U4.3 ; 18.28,22.04 R15.2 18.22,20.55 C20.1 ; 18.28,22.04 18.28,20.38 14.61,16.71 13.85,16.71 U5.13 12.45,16.58 11.18,15.31 11.18,13.02 10.67,12.52 10.67,11.75 ; 18.28,22.04 18.28,22.22 19.04,22.99 v1(19.04,24.51) ; 23.21,48.82 23.25,48.85 U2.41 ; 23.21,48.82 22.92,48.82 ; 23.21,48.82 24.36,48.82 U2.41 ; 17.33,58.21 U2.1 ; 17.33,58.21 16.57,58.98 C8.1 15.53,59.47 15.53,61.77 15.03,62.28 13.76,62.28 ; 17.33,58.21 18.2,58.21 22.92,53.5 22.92,52.12 ; 10.96,62.02 10.96,62.28 8.87,64.37 ; 10.96,62.02 12.23,62.02 12.49,62.28 13.76,62.28 ; 10.96,62.02 10.71,61.77 10.71,56.18 10.6,56.07 ; 26.55,51.01 26.55,49.1 26.43,48.98 26.17,48.98 U2.41 ; 26.55,51.01 26.55,51.1 ; 26.55,51.01 U2.41 ; 8.12,33.42 C15.2 ; 8.12,33.42 8.38,33.42 9.39,32.4 9.39,22.49 8.63,21.73 8.63,21.48 ; 8.12,33.42 C14.2 8.25,35.3 v1(9.69,35.3) ; 24.18,52.37 26.05,52.37 ; 24.18,52.37 U2.41 U2.41 ; 24.18,52.37 23.29,52.37 23.03,52.12 ; 26.05,52.37 26.3,52.12 ; 26.05,52.37 26.05,53.64 26.81,54.4 v1(26.81,54.66) 30.38,58.22 U2.40 ; v1(20.5,18.73) 20.5,16.57 21.15,15.93 22.84,15.93 ; 22.92,48.82 22.92,50.59 ; 22.92,48.82 v1(22.92,45.26) ; H5.3 31.95,9.08 26.68,9.08 ; 22.92,52.12 23.03,52.12 ; 22.92,52.12 22.16,52.12 21.65,51.61 21.65,51.1 22.16,50.59 22.92,50.59 ; 23.03,52.12 U2.41 ; 26.3,52.12 26.55,51.86 26.55,51.1 ; 26.3,52.12 U2.41 ; C12.1 9.92,11.75 10.67,11.75 ; 13.76,62.28 13.76,63.22 Q1.2 ; 9.14,17.16 9.14,18.94 8.63,19.45 8.63,21.48 ; 9.14,17.16 8.06,17.16 U5.3 ; 9.14,17.16 9.14,15.67 8.88,15.42 8.12,15.42 U5.6 ; 22.92,50.59 23.17,50.59 U2.41 ; C17.2 9.09,21.48 8.63,21.48 ; 10.6,56.07 11.61,55.06 11.87,55.06 ; 10.6,56.07 8.89,56.07 R3.1 7.61,56.14 USBC1.B1A12 6.45,56.95 USBC1.1 v1(4.66,55.16) ; 11.87,41.34 C10.2 13.97,40.83 R16.1 ; 26.55,51.1 v1(26.81,50.85) ; 10.67,11.75 10.67,10.86 v1(10.42,10.6) ; 8.87,64.37 R2.1 ; 8.87,64.37 7.11,64.37 USBC1.A1B12 6.45,64.06 5.68,64.83 1.5,64.83
  Top Layer w0.5: 27.73,15.2 27.48,15.2 26.58,14.3 26.58,11.81 C11.1 ; U4.6 27.56,17.23 26.97,16.64 26.97,15.7 27.46,15.2 ; C1.2 11.87,55.06 11.11,54.29 11.11,42.86 11.61,42.36 11.61,41.59 11.87,41.34 9.78,41.34 U1.4
  Top Layer w1: 24.05,6.31 25.38,7.65 25.38,7.79 26.68,9.08 26.68,11.65 C11.1 ; H1.3 23.93,4.57 C16.2 23.88,5.77 ; v1(10.42,10.6) 10.42,10.35 11.69,9.08 12.76,9.08 12.76,9.08 13.74,9.08 13.74,9.08 18.04,9.08 19.56,10.6 19.56,10.22 23.6,6.19
  Inner2 w0.254: v1(20.5,18.73) 20.5,19.75 19.04,21.21 v1(19.04,24.51)
  Bottom Layer w0.25: 19.24,32.86 19.24,33.36 17.97,34.63 U6.17 17.97,35.65 17.31,36.31 15.04,36.31 U3.G1 ; 19.24,32.86 19.45,32.64 23.26,32.64 23.52,32.39 23.52,30.86 23.29,30.64 22.53,30.64 ; 19.24,32.86 17.47,31.09 U6.5 U6.6 13.93,30.64 C22.1 ; U7.2 22.53,29.96 22.53,30.64 ; 22.53,30.64 20.75,30.64 20.25,30.13 19.48,30.13 U6.2
  Bottom Layer w0.254: 22.92,44.38 24.57,44.38 C23.2 24.63,43.18 C3.1 ; 22.92,44.38 v1(22.92,45.26) ; 22.92,44.38 C24.2 ; v1(10.42,10.6) 10.35,10.6 C6.1 4.59,7.43 H6.3 ; U3.G2 6.54,35.3 v1(9.69,35.3) 10.71,35.3 12.74,37.33 U3.G1 13.75,37.59 13.75,41.13 14.46,41.83 ; 21.88,52.95 20.61,52.95 19.34,51.68 14.26,51.68 ; 21.88,52.95 21.88,52.38 U8.6 ; 21.88,52.95 23.15,54.22 ; 14.26,51.68 14.77,51.17 14.77,48.89 13.75,47.87 13.75,42.54 14.46,41.83 ; 14.26,51.68 U3.G4 13.87,52.07 12.38,52.07 ; C5.1 29.27,9.08 28.89,9.08 20.5,17.46 v1(20.5,18.73) ; 12.38,52.07 11.62,52.07 10.86,52.83 U3.G3 4.51,55.01 ; 12.38,52.07 11.88,52.58 11.88,56.28 C9.1 ; 14.46,41.83 U3.6 ; USBC1.2 2.67,55.01 4.51,55.01 ; 27.32,54.91 27.06,54.91 v1(26.81,54.66) ; 27.32,54.91 27.7,54.91 U9.3 ; 27.32,54.91 27.32,57.73 R28.2 ; 23.15,54.22 23.29,54.22 U8.25 ; 23.15,54.22 23.59,54.66 U8.16 ; 0.43,10.41 0.44,10.42 0.44,12.7 ; R20.1 35.17,36.89 Q4.2 35.57,34.89 35.57,33.15 34.56,32.13 29.01,32.13 ; 32.06,50.66 31.13,51.6 31.13,53.5 30.98,53.64 29.6,53.64 v1(26.81,50.85) ; 23.52,32.39 24.02,32.9 28.25,32.9 29.01,32.13 ; 29.01,32.13 29.01,30.48 H2.4 27.74,26.23 C4.1 32.16,24.83 H4.3 ; v1(4.66,55.16) 4.51,55.01 ; U7.2 22.45,27.92 C2.1 v1(19.04,24.51) 6.6,24.51 C7.1 4.84,24.06 H7.3
  vias: v1(5.44,51.16) v1(5.44,46.08) v1(9.7,52.81) v1(9.7,47.73) v1(10.52,56.24) v1(10.52,51.16) v1(15.6,61.32) v1(20.89,10.52) v1(20.89,5.44) v1(25.97,10.52) v1(25.97,5.44) v1(30.84,56.24) v1(32.13,34.43) v1(32.13,29.35)
VBATT: length 53.8
  Bottom Layer w0.254: 32.07,46.12 36,42.19 36,21.21 30.92,16.13 30.92,7.75 29.14,5.97 29.14,3.43 27.11,1.4 H3.1
VIN_: length 41.3
  Top Layer w0.5: v1(10.5,13.31) 10.5,37.94 U1.3 ; U1.3 11.24,38.8 C10.1 ; U1.3 U1.2
  Bottom Layer w0.5: R5.1 11.12,2.79 Q2.1 Q2.2 Q3.1 11.12,9.46 12,10.34 R6.2 v1(10.5,13.31)
VIN_5V: length 75.8
  Top Layer w0.3: USBC1.A4B9 6.32,62.91 6.25,62.83 5.77,62.83 5.49,62.56 5.49,62.3 4.79,61.6 4.79,58.66 5.02,58.43 5.52,58.43 5.84,58.11 USBC1.B4A9
  Top Layer w0.5: 4.79,58.66 4.25,58.12 4.25,57.79 3.87,57.4 3.87,54.74 6.41,52.2 6.41,44.83 6.53,44.7 v1(6.53,44.58)
  Inner2 w1: H1.1 6.15,10.92 6.15,44.2 v1(6.53,44.58)
  Bottom Layer w0.254: 13.14,2.41 R5.2
  Bottom Layer w0.5: Q2.3 13.14,5.06 13.14,2.41 13.39,2.41 14.41,1.4 H1.1
BNO085_INT: length 7.6
  Top Layer w0.25: v1(17.38,34.39) 18.15,35.15 18.15,39.42 19.16,40.43
  Bottom Layer w0.25: v1(17.38,34.39) 17.13,34.64 U6.14
BOARD_RESET#: length 34.6
  Inner1 w0.25: v1(17.67,33.65) 18.18,34.16 18.18,41.52 17.93,41.78 17.93,44.83 18.43,45.33 19.19,45.33 v1(20.47,46.6)
  Bottom Layer w0.25: v1(20.47,46.6) 23.51,46.6 24.59,47.68 U8.1 ; v1(17.67,33.65) 17.16,33.14 U6.11 16.39,33.14 16.17,32.93 13.46,32.93 13.01,32.48 13.01,28.83
  Bottom Layer w0.254: R29.1 13.38,28.83 12.5,28.83 11.74,29.59
BUTTON: length 41.4
  Top Layer w0.254: R15.1 17.19,23.49 SW1.3 SW1.4 v1(16.37,37.16)
  Inner2 w0.254: v1(24.09,56.93) 23.33,56.17 21.96,56.17 21.45,56.68 21.19,56.68 20.66,56.14 19.71,56.14 19.24,55.68 19.04,55.68 16.88,53.51 16.88,37.67 v1(16.37,37.16)
  Bottom Layer w0.254: v1(24.09,56.93) U8.17
DTR: length 1.4
  Bottom Layer w0.254: R7.1 TP2.1
ESP_D+: length 23.2
  Top Layer w0.254: v1(13.05,52.89) 12.54,52.38 12.54,46.06 16.89,41.71 17.4,41.71 ; v1(12.54,55.93) 11.23,57.24 11.23,59.45 R9.2
  Bottom Layer w0.254: v1(12.54,55.93) 12.7,55.93 14.66,53.97 13.57,52.89 v1(13.05,52.89)
ESP_D-: length 23.3
  Top Layer w0.254: U2.13 17.37,43.01 16.87,43.01 13.31,46.56 13.31,51.62 16.1,54.42 v1(16.1,54.67) ; v1(13.06,59.5) 13.06,59.75 R10.2
  Inner1 w0.254: v1(13.06,59.5) 13.06,57.72 v1(16.1,54.67)
ESP_EN: length 14.6
  Top Layer w0.254: 13.19,53.6 R4.1 15.98,55.68 U2.3 ; 13.19,53.6 12.94,53.86 12.94,55.38 13.7,56.14 13.7,60.3 Q1.3 ; 13.19,53.6 12.68,53.6 12.63,53.66 C1.1
ESP_IO0: length 17.5
  Top Layer w0.254: v1(34.9,33.97) 34.9,41.71
  Bottom Layer w0.254: Q4.3 v1(34.9,33.97) 34.39,34.47 34.39,40.34 R8.1
LED_I: length 50.8
  Top Layer w0.254: U2.33 34.39,49.33 v1(33.37,48.32) ; v1(21.81,11.18) 21.54,11.18 20.41,12.32 17.82,12.32 LED1.4
  Inner2 w0.254: v1(33.37,48.32) 32.36,48.32 26.26,42.22 26.26,31.81 26.51,31.55 26.51,15.88 v1(21.81,11.18)
MA1: length 5.2
  Top Layer w0.5: H5.1 32.17,11.9 29.44,14.63 U4.2
MA2: length 11.4
  Top Layer w0.5: H5.2 35.27,11.13 35.27,13.42 32.77,15.93 U4.4
MB1: length 11.6
  Top Layer w0.5: U4.7 29.58,17.88 30.17,18.47 30.17,25.36 H4.1
MB2: length 15.8
  Top Layer w0.5: H4.2 35.96,24.41 35.96,19.77 32.72,16.53 28.62,16.53 U4.5
MC1: length 5.2
  Top Layer w0.5: U5.2 7.06,17.88 4.38,20.56 H7.1
MC2: length 11.4
  Top Layer w0.5: U5.4 3.8,16.58 1.27,19.11 1.27,21.33 H7.2
MC_2_ULT: length 67.1
  Top Layer w0.254: U5.8 8.75,13.98 9.66,14.89 v1(9.66,15.14) ; v1(25.91,30.78) 26.42,30.27 26.42,20.69 28.58,18.53
  Inner1 w0.254: v1(25.91,30.78) 24.39,30.78 15.75,22.15 15.75,21.24 v1(9.66,15.14)
  Inner2 w0.254: v1(21.34,55.93) 21.34,54.15 26.42,49.07 26.42,43.48 25.66,42.72 25.66,31.8 25.91,31.54 v1(25.91,30.78)
  Bottom Layer w0.254: 21.34,55.42 v1(21.34,55.93)
MD1: length 19.4
  Top Layer w0.5: U5.5 3.8,15.93 0.55,12.68 0.55,6.72 1.12,6.16 1.12,5.9 1.79,5.22 4.26,5.22 H6.1
MD2: length 11.9
  Top Layer w0.5: H6.2 2.27,7.16 3.99,8.89 4.88,8.89 6.27,10.28 6.27,14.17 6.73,14.63 U5.7
MISO: length 25.1
  Top Layer w0.254: U2.36 34.39,53.14 24.99,43.75 21.43,43.75 v1(19.4,41.71)
  Bottom Layer w0.254: U3.7 14.94,40.77 TP5.1 18.45,40.77 v1(19.4,41.71)
MOSI: length 33.1
  Top Layer w0.254: v1(20.1,49.66) 21.11,48.64 21.11,46.1 22.64,44.58 23.14,44.58 32.98,54.41 U2.37
  Bottom Layer w0.254: v1(20.1,49.66) 17.05,49.66 16.03,48.64 16.03,47.12 16.29,46.86 16.54,46.86 16.95,46.45 16.95,45.18 ; U3.3 14.96,45.18 16.95,45.18 ; 16.95,45.18 TP4.1
PA1: length 46.1
  Top Layer w0.254: U2.4 16.89,54.41 16.13,53.65 16.13,50.35 v1(15.87,50.1) ; v1(22.34,13.47) 22.84,13.98
  Inner2 w0.254: v1(22.34,13.47) 21.46,14.35 21.46,23.17 14.86,29.78 14.86,49.08 v1(15.87,50.1)
PA2: length 42.9
  Top Layer w0.254: U2.5 18.16,53.14 v1(18.92,52.38) ; v1(24.12,14.88) 23.86,14.63 22.84,14.63
  Inner2 w0.254: v1(18.92,52.38) 18.92,47.05 22.84,43.12 22.84,16.16 v1(24.12,14.88)
PB1: length 39.6
  Top Layer w0.254: v1(23.61,19.25) 24.12,18.74 24.12,18.39 23.61,17.88 22.84,17.88 ; U2.6 17.9,51.37 20.7,51.37 v1(20.95,51.11)
  Inner2 w0.254: v1(20.95,51.11) 20.95,48.06 23.61,45.41 23.61,34.74 23.35,34.49 23.35,19.5 v1(23.61,19.25)
PB2: length 34.8
  Top Layer w0.254: 22.84,18.53 22.22,19.15 v1(22.22,20.63) ; v1(20.44,44.51) 19.68,45.27 19.68,49.08 18.16,50.6 U2.7
  Inner2 w0.254: v1(20.44,44.51) 20.44,42.48 22.22,40.7 v1(22.22,20.63)
PC1: length 28.8
  Top Layer w0.254: 29.32,40.43 29.32,39.93 27.54,38.15 26.78,38.15 23.99,35.35 v1(23.99,34.08) ; v1(15.6,25.7) 15.6,21.13 13.83,19.35 13.83,18.64 13.72,18.53
  Inner1 w0.254: v1(23.99,34.08) v1(15.6,25.7)
PC2: length 31.8
  Top Layer w0.254: 22.97,40.43 22.97,40.94 v1(22.21,41.7) ; U5.15 12.96,17.88 12.45,18.39 12.45,33.98 v1(15.6,37.13)
  Bottom Layer w0.254: v1(22.21,41.7) 18.4,37.89 16.11,37.89 15.6,37.39 v1(15.6,37.13)
PD1: length 35
  Top Layer w0.254: 31.86,40.43 31.86,36.37 28.56,33.07 27.29,33.07 24.24,30.02 v1(24.24,25.7) ; U5.10 13.82,14.53 v1(15.1,14.53)
  Inner1 w0.254: v1(15.1,14.53) 15.1,16.56 v1(24.24,25.7)
PD2: length 34.9
  Top Layer w0.254: v1(29.83,38.66) 30.59,39.42 30.59,40.43 ; v1(17.13,16.12) 17.13,15.11 15.86,13.84 13.86,13.84 U5.9
  Inner1 w0.254: v1(29.83,38.66) 29.83,29.58 17.13,16.88 v1(17.13,16.12)
RTS: length 2.2
  Top Layer w0.254: R1.1 13.14,65.02 TP1.1
SC16IS750_IRQ#: length 22.9
  Top Layer w0.254: v1(21.59,42.32) 21.59,40.54 21.7,40.43 21.7,37.51 R27.2
  Inner1 w0.254: v1(21.59,42.32) 21.34,42.57 21.34,50.45 21.59,50.7 21.59,52.99 19.49,55.1 v1(19.28,55.1)
  Bottom Layer w0.254: v1(19.28,55.1) 19.28,55.76 19.81,56.29 20.07,56.29 20.58,55.78 20.58,55.18 20.83,54.92 U8.11
SCL: length 49.1
  Top Layer w0.254: U2.35 34.39,51.88 27.78,45.27 v1(27.78,45.02)
  Inner1 w0.254: v1(27.78,45.02) 27.78,36.87 H2.1
  Inner2 w0.254: v1(18.94,53.31) 17.96,52.32 17.96,37.46 v1(18.97,36.45)
  Bottom Layer w0.25: v1(18.97,36.45) 18.97,35.15
  Bottom Layer w0.254: U8.9 20.82,53.92 19.99,53.09 19.16,53.09 v1(18.94,53.31) ; H2.1 27.36,36.45 v1(18.97,36.45)
SD_CS: length 16.8
  Inner1 w0.254: v1(16.18,46.23) 16.48,46.54 16.48,53.12 20.55,57.19 v1(23.34,57.19)
  Bottom Layer w0.254: v1(16.18,46.23) U3.2
SDA: length 51.3
  Top Layer w0.254: U2.12 18.29,44.25 v1(18.54,44.51)
  Inner1 w0.254: v1(18.54,44.51) 18.54,43.49 H2.2 27.74,34.74 28.87,35.86 28.87,46.62 v1(19.99,55.5)
  Bottom Layer w0.25: 19.78,35.14 20.07,35.43 26.6,35.43 H2.2
  Bottom Layer w0.254: U8.10 20.58,54.42 19.99,55 v1(19.99,55.5)
SPI_SCK: length 23.2
  Top Layer w0.254: U2.34 34.39,50.6 27.78,44 26.77,44 25.75,42.98 22.2,42.98 v1(22.15,42.93)
  Bottom Layer w0.254: v1(22.15,42.93) U3.5
UART1_RX: length 45.8
  Top Layer w0.254: U2.11 17.65,45.27 18.67,45.27 19.17,44.76 19.17,42.48 v1(18.67,41.97)
  Inner1 w0.254: v1(18.67,41.97) 18.67,41.46 26.54,33.59 26.54,28.88 v1(20.7,23.04)
  Bottom Layer w0.254: 34.27,21.01 30.71,21.01 R14.2 28.67,18.97 24.76,18.97 v1(20.7,23.04)
UART1_TX: length 35.9
  Top Layer w0.254: v1(18.67,46.03) 17.9,46.79 U2.10
  Inner2 w0.254: v1(18.67,46.03) 19.68,45.02 19.68,42.48 21.71,40.44 21.71,26.34 v1(21.46,26.09)
  Bottom Layer w0.254: v1(21.46,26.09) 24.25,23.29 27.81,23.29 R13.2 31.35,21.46 H4.5
UART2_RX: length 60.1
  Top Layer w0.254: v1(27.03,41.96) 28.05,40.94 28.05,40.43
  Inner1 w0.254: v1(27.03,41.96) 27.03,43.48 v1(25.34,45.18)
  Inner2 w0.254: v1(33.51,4.29) H5.6 35.42,6.2 35.42,13.15 29.07,19.5 29.07,39.93 v1(27.03,41.96)
  Bottom Layer w0.254: v1(33.51,4.29) 32.88,4.93 30.76,4.93 29.89,4.06 R19.2 ; U8.24 25.09,52.67 25.09,45.43 v1(25.34,45.18)
UART2_TX: length 68.3
  Top Layer w0.254: v1(33.11,47.02) 32.85,47.02 29.32,43.48 26.93,43.48 24.24,40.8 24.24,40.43
  Inner1 w0.254: v1(31.4,5.56) H5.5 30.9,7.59 30.9,34.14 34.38,37.62 34.38,45.75 v1(33.11,47.02)
  Bottom Layer w0.254: v1(33.11,47.02) 34.12,47.02 34.38,47.27 34.38,50.86 U9.4 ; v1(31.4,5.56) 29.99,5.56 R21.2
UART2_TX_EN: length 14.8
  Bottom Layer w0.254: 27.97,58.55 28.73,57.78 28.73,53.72 28.03,53.02 U9.1 ; 27.97,58.55 23.69,58.55 22.59,57.44 U8.14 ; 27.97,58.55 28.12,58.55 R28.1
UART3_RX: length 41.4
  Top Layer w0.254: 25.51,40.43 25.51,38.4 20.94,33.83 v1(20.94,28.75)
  Inner1 w0.254: v1(7.22,12.87) 7.22,16.3 19.67,28.75 v1(20.94,28.75)
  Bottom Layer w0.254: H6.6 5.81,11.45 R17.2 v1(7.22,12.87)
UART3_TX: length 41.5
  Top Layer w0.254: 26.78,40.43 26.78,38.91 21.7,33.83 21.7,27.23 20.69,26.21 20.69,25.45 v1(20.94,25.19)
  Bottom Layer w0.254: v1(20.94,25.19) 8.75,13 8.75,11.6 8.45,11.3 7.18,11.3 R18.2 4.73,10.54 H6.5
UART4_RX: length 36.1
  Top Layer w0.254: U2.9 15.11,48.06 v1(14.09,49.08)
  Bottom Layer w0.254: H7.6 5.76,27.41 R12.2 2.99,32.77 2.99,37.91 3.71,38.63 4.4,38.63 6.57,40.8 6.57,41.49 14.09,49.01 v1(14.09,49.08)
UART4_TX: length 32.6
  Top Layer w0.254: U2.8 14.86,49.33 v1(14.09,50.1)
  Inner2 w0.254: v1(8.58,32.39) 8.58,44.58 v1(14.09,50.1)
  Bottom Layer w0.254: v1(8.58,32.39) 7.81,31.62 7.81,27.94 R11.2 6.03,26.16 4.4,26.16 H7.5
USB_D+: length 6.3
  Top Layer w0.254: R9.1 8.96,60.8 8.53,60.8 7.48,59.74 ; 7.48,59.74 7.48,59.87 7.39,59.96 7.39,60.55 7.18,60.76 6.45,60.76 ; 7.48,59.74 6.46,59.74 USBC1.B6
USB_D-: length 6.3
  Top Layer w0.254: R10.1 6.47,61.28 USBC1.B7 5.68,61.26 5.43,61 5.43,60.49 5.67,60.26 USBC1.A7
$1N832: length 2.8
  Top Layer w0.254: R3.2 7.71,58.76 USBC1.B5
$1N836: length 3
  Top Layer w0.254: 8.87,63.08 7.54,61.76 USBC1.A5
$1N2105: length 3.2
  Bottom Layer w0.254: Q4.1 32.16,35.29 R7.2
$1N2214: length 1.8
  Top Layer w0.254: R1.2 15.61,64.83 Q1.1
$1N18310: length 4.5
  Top Layer w0.254: U2.32 34.13,48.06 v1(33.69,47.62)
  Bottom Layer w0.254: 32.06,49.16 32.07,49.15 32.07,47.62 v1(33.69,47.62)
$1N21267: length 3.7
  Top Layer w0.254: 20.43,40.43 20.43,38.8 R16.2
$1N21376: length 3.7
  Top Layer w0.254: U2.26 33.13,39.19 33.59,38.73 v1(33.59,37.72)
  Bottom Layer w0.254: v1(33.59,37.72) R20.2
$1N26653: length 10.3
  Top Layer w0.254: C13.1 9.01,41.52 U1.5 8.69,40.7 8.19,40.19 6.04,40.19 L1.1
$1N26903: length 3.7
  Top Layer w0.254: 7.74,41.2 7.61,41.34 C13.2
$1N27406: length 1.9
  Top Layer w0.254: LED1.2 21.6,6.41 TP6.1
$2N2668: length 2.4
  Top Layer w0.254: C18.2 22.74,15.17 22.84,15.28
$2N2750: length 3.9
  Top Layer w0.254: C19.2 21.66,18.55 21.66,17.65 22.08,17.23 22.84,17.23
$2N2983: length 3.8
  Top Layer w0.254: C20.2 15.93,18.68 14.48,17.23 U5.14
$2N2989: length 2.3
  Top Layer w0.254: C21.2 13.82,15.17 U5.11
$3N396: length 6.1
  Bottom Layer w0.25: R25.1 12.88,36.07 14.4,36.07 14.65,35.81 16.8,35.81 U6.16
$3N399: length 2.8
  Bottom Layer w0.25: U6.15 16.5,35.3 R26.1
$3N402: length 5
  Bottom Layer w0.25: R24.2 17.97,28.46 U6.4
  Bottom Layer w0.254: R24.2 15.57,27.83 TP7.1
$3N405: length 2.8
  Bottom Layer w0.25: C22.2 16.58,32.07 U6.9
$3N910: length 2.7
  Bottom Layer w0.25: U7.3 22.39,31.64 19.78,31.64
$3N976: length 12.7
  Inner2 w0.254: v1(25.78,46.35) v1(24,48.13)
  Bottom Layer w0.254: U8.2 24.09,48.22 v1(24,48.13) ; v1(25.78,46.35) 26.79,45.34 27.05,45.34 ; X1.2 28.18,46.47 27.05,45.34 ; C23.1 27.05,45.34
$3N1443: length 2.6
  Bottom Layer w0.254: U9.2 26.4,53.97 25.85,53.42 U8.23
$3N1678: length 11
  Bottom Layer w0.254: C24.1 19.18,46.6 X1.1 19.8,47.88 23.61,51.69 23.61,52.15 U8.3

## Copper pours and planes (outline as drawn; the poured copper is in the pictures)
GND on Top Layer: 23.25,51.91 26.05,51.91 26.05,49.1 23.25,49.1
GND on Top Layer: 0,65.91 36.51,65.91 36.51,0 0,0
GND on Bottom Layer: 0,65.91 36.51,65.91 36.51,0 0,0
GND on Inner1: 0,65.79 36.51,65.79 36.51,0 0,0
GND on Inner2: 0,65.91 36.51,65.91 36.51,0 0,0
